# Altium project master-010106.PrjPcb (part 4 of 5)

## Sheet contactor_control.SchDoc: foxBMS BMS-Master
size A3; DocumentNumber: 16; SheetNumber: 16; SheetTotal: 24; Author: Fraunhofer IISB foxBMS Team; REL-DATE: 2017-05-16; VERSION: 1.0.2; SheetDescription: Contactor Control
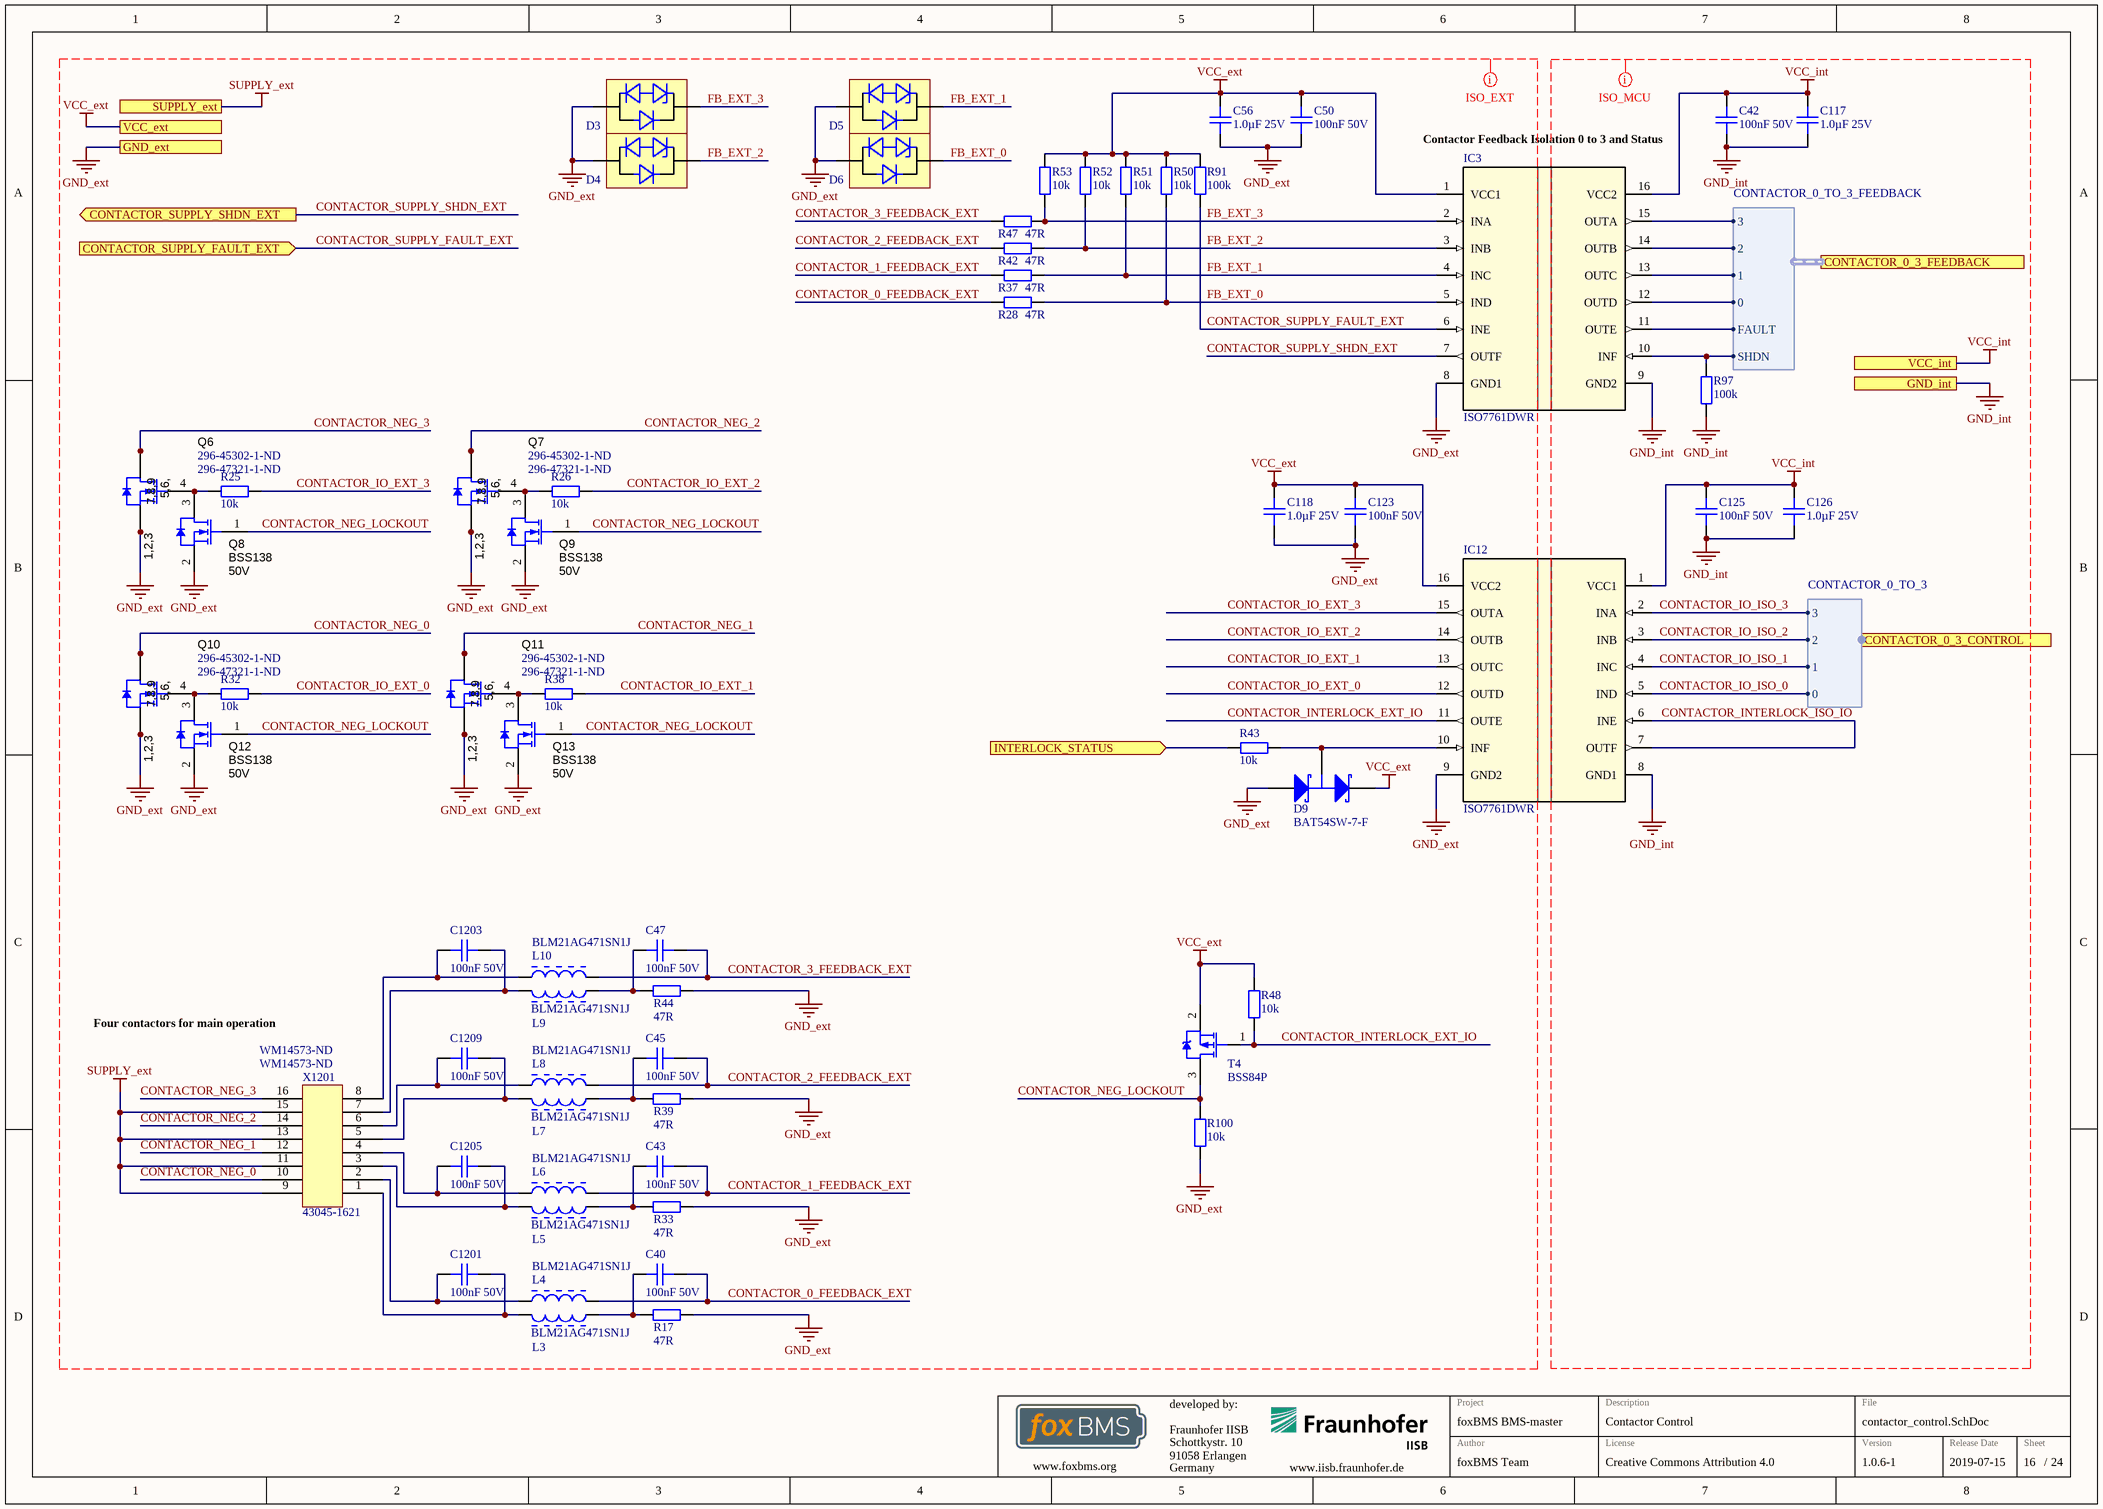
[diagram p18: contactor_control.SchDoc]

### Parts
(Parts that share a designator on the sheet are numbered #1, #2 ... from top to bottom, then left to right.)
C40  100nF 50V  [0603C]
C42  100nF 50V  [0603C]
C43  100nF 50V  [0603C]
C45  100nF 50V  [0603C]
C47  100nF 50V  [0603C]
C50  100nF 50V  [0603C]
C56  1.0µF 25V  [0603C]
C117#2  1.0µF 25V  [0603C]
C118  1.0µF 25V  [0603C]
C123  100nF 50V  [0603C]
C125  100nF 50V  [0603C]
C126  1.0µF 25V  [0603C]
C1201  100nF 50V  [0603C]
C1203  100nF 50V  [0603C]
C1205  100nF 50V  [0603C]
C1209  100nF 50V  [0603C]
D3  CDSOD323-T05  [SODFL250X110-2N]  (value not drawn)
D4  CDSOD323-T05  [SODFL250X110-2N]  (value not drawn)
D5#2  CDSOD323-T05  [SODFL250X110-2N]  (value not drawn)
D6#2  CDSOD323-T05  [SODFL250X110-2N]  (value not drawn)
D9  BAT54SW-7-F  [DIOD-SOT323-3_V]
IC3#1  ISO7761DWR  [DW0016B_N]
IC12  ISO7761DWR  [DW0016B_N]
L3  BLM21AG471SN1J  [MURA-BLM21-H1-CHIP-2_V]
L4  BLM21AG471SN1J  [MURA-BLM21-H1-CHIP-2_V]
L5  BLM21AG471SN1J  [MURA-BLM21-H1-CHIP-2_V]
L6  BLM21AG471SN1J  [MURA-BLM21-H1-CHIP-2_V]
L7  BLM21AG471SN1J  [MURA-BLM21-H1-CHIP-2_V]
L8  BLM21AG471SN1J  [MURA-BLM21-H1-CHIP-2_V]
L9  BLM21AG471SN1J  [MURA-BLM21-H1-CHIP-2_V]
L10  BLM21AG471SN1J  [MURA-BLM21-H1-CHIP-2_V]
Q6  Supplier Part Number 1: 296-45302-1-ND  Supplier Part Number 2: 296-47321-1-ND  [SONQ3A]  (hidden comment: CSD18543Q3A)
Q7  Supplier Part Number 1: 296-45302-1-ND  Supplier Part Number 2: 296-47321-1-ND  [SONQ3A]  (hidden comment: CSD18543Q3A)
Q8  BSS138  value 50V  [SOT-23]
Q9  BSS138  value 50V  [SOT-23]
Q10  Supplier Part Number 1: 296-45302-1-ND  Supplier Part Number 2: 296-47321-1-ND  [SONQ3A]  (hidden comment: CSD18543Q3A)
Q11  Supplier Part Number 1: 296-45302-1-ND  Supplier Part Number 2: 296-47321-1-ND  [SONQ3A]  (hidden comment: CSD18543Q3A)
Q12#2  BSS138  value 50V  [SOT-23]
Q13#2  BSS138  value 50V  [SOT-23]
R17  47R  [0603R]
R25  10k  [0603R]
R26  10k  [0603R]
R28  47R  [0603R]
R32  10k  [0603R]
R33  47R  [0603R]
R37  47R  [0603R]
R38  10k  [0603R]
R39  47R  [0603R]
R42  47R  [0603R]
R43  10k  [0603R]
R44  47R  [0603R]
R47#2  47R  [0603R]
R48#2  10k  [0603R]
R50#2  10k  [0603R]
R51#2  10k  [0603R]
R52#2  10k  [0603R]
R53#2  10k  [0603R]
R91  100k  [0603R]
R97  100k  [0603R]
R100#1  10k  [0603R]
T4  BSS84P  [INF-PG-SOT23_N]
X1201  43045-1621  Supplier Part Number 1: WM14573-ND  [43045-1621]

### Ports
CONTACTOR_0_3_CONTROL (harness CONTACTOR_0_TO_3), CONTACTOR_0_3_FEEDBACK (harness CONTACTOR_0_TO_3_FEEDBACK), CONTACTOR_SUPPLY_FAULT_EXT (in), CONTACTOR_SUPPLY_SHDN_EXT (out), GND_ext, GND_int, INTERLOCK_STATUS (in), SUPPLY_ext, VCC_ext, VCC_int

### Harnesses
CONTACTOR_0_TO_3: 0, 1, 2, 3
CONTACTOR_0_TO_3_FEEDBACK: 0, 1, 2, 3, FAULT, SHDN

### Nets
GND_ext: C42.2 C50.2 C56.2 C117#2.2 C118.2 C123.2 C125.2 C126.2 D3.2(A) D4.2(A) D5#2.2(A) D6#2.2(A) D9.1(A) IC3#1.8(GND1) IC3#1.9(GND2) IC12.8(GND1) IC12.9(GND2) Q6.1(S) Q6.2(S) Q6.3(S) Q7.1(S) Q7.2(S) Q7.3(S) Q8.2(S) Q9.2(S) Q10.1(S) Q10.2(S) Q10.3(S) Q11.1(S) Q11.2(S) Q11.3(S) Q12#2.2(S) Q13#2.2(S) R17.2 R33.2 R39.2 R44.2 R97.1 R100#1.1 ; port GND_int, port GND_ext  [also labelled GND_int]  [project net GND]
SUPPLY_ext: X1201.9 X1201.11 X1201.13 X1201.15 ; port SUPPLY_ext
VCC_ext: C50.1 C56.1 C118.1 C123.1 D9.2(K) IC3#1.1(VCC1) IC12.16(VCC2) R48#2.2 R50#2.2 R51#2.2 R52#2.2 R53#2.2 R91.2 T4.2(SOURCE) ; port VCC_ext  [project net +3.3V_COM]
VCC_int: C42.1 C117#2.1 C125.1 C126.1 IC3#1.16(VCC2) IC12.1(VCC1) ; port VCC_int  [project net +3.3V_0]
CONTACTOR_0_FEEDBACK: IC3#1.12(OUTD) ; port CONTACTOR_0_3_FEEDBACK.0
CONTACTOR_0_FEEDBACK_EXT: C40.2 L4.2 R28.1
CONTACTOR_1_FEEDBACK: IC3#1.13(OUTC) ; port CONTACTOR_0_3_FEEDBACK.1
CONTACTOR_1_FEEDBACK_EXT: C43.2 L6.2 R37.1
CONTACTOR_2_FEEDBACK: IC3#1.14(OUTB) ; port CONTACTOR_0_3_FEEDBACK.2
CONTACTOR_2_FEEDBACK_EXT: C45.2 L8.2 R42.1
CONTACTOR_3_FEEDBACK: IC3#1.15(OUTA) ; port CONTACTOR_0_3_FEEDBACK.3
CONTACTOR_3_FEEDBACK_EXT: C47.2 L10.2 R47#2.2
CONTACTOR_INTERLOCK_EXT_IO: IC12.11(OUTE) R48#2.1 T4.1(GATE)
CONTACTOR_INTERLOCK_ISO_IO: IC12.6(INE) IC12.7(OUTF)
CONTACTOR_IO_EXT_0: IC12.12(OUTD) R32.1
CONTACTOR_IO_EXT_1: IC12.13(OUTC) R38.1
CONTACTOR_IO_EXT_2: IC12.14(OUTB) R26.1
CONTACTOR_IO_EXT_3: IC12.15(OUTA) R25.1
CONTACTOR_IO_ISO_0: IC12.5(IND) ; port CONTACTOR_0_3_CONTROL.0  [project net CONTACTOR_0_CONTROL]
CONTACTOR_IO_ISO_1: IC12.4(INC) ; port CONTACTOR_0_3_CONTROL.1  [project net CONTACTOR_1_CONTROL]
CONTACTOR_IO_ISO_2: IC12.3(INB) ; port CONTACTOR_0_3_CONTROL.2  [project net CONTACTOR_2_CONTROL]
CONTACTOR_IO_ISO_3: IC12.2(INA) ; port CONTACTOR_0_3_CONTROL.3  [project net CONTACTOR_3_CONTROL]
CONTACTOR_NEG_0: Q10.5(D) Q10.6(D) Q10.7(D) Q10.8(D) Q10.9(D) X1201.10
CONTACTOR_NEG_1: Q11.5(D) Q11.6(D) Q11.7(D) Q11.8(D) Q11.9(D) X1201.12
CONTACTOR_NEG_2: Q7.5(D) Q7.6(D) Q7.7(D) Q7.8(D) Q7.9(D) X1201.14
CONTACTOR_NEG_3: Q6.5(D) Q6.6(D) Q6.7(D) Q6.8(D) Q6.9(D) X1201.16
CONTACTOR_NEG_LOCKOUT: Q8.1(G) Q9.1(G) Q12#2.1(G) Q13#2.1(G) R100#1.2 T4.3(DRAIN)
CONTACTOR_SUPPLY_FAULT: IC3#1.11(OUTE) ; port CONTACTOR_0_3_FEEDBACK.FAULT
CONTACTOR_SUPPLY_FAULT_EXT: IC3#1.6(INE) R91.1 ; port CONTACTOR_SUPPLY_FAULT_EXT
CONTACTOR_SUPPLY_SHDN: IC3#1.10(INF) R97.2 ; port CONTACTOR_0_3_FEEDBACK.SHDN
CONTACTOR_SUPPLY_SHDN_EXT: IC3#1.7(OUTF) ; port CONTACTOR_SUPPLY_SHDN_EXT
FB_EXT_0: D6#2.1(K) IC3#1.5(IND) R28.2 R50#2.1
FB_EXT_1: D5#2.1(K) IC3#1.4(INC) R37.2 R51#2.1
FB_EXT_2: D4.1(K) IC3#1.3(INB) R42.2 R52#2.1
FB_EXT_3: D3.1(K) IC3#1.2(INA) R47#2.1 R53#2.1
INTERLOCK_STATUS: R43.2 ; port INTERLOCK_STATUS
NetC40_1: C40.1 L3.2 R17.1
NetC43_1: C43.1 L5.2 R33.1
NetC45_1: C45.1 L7.2 R39.1
NetC47_1: C47.1 L9.2 R44.1
NetC1201_1: C1201.1 L4.1 X1201.2
NetC1201_2: C1201.2 L3.1 X1201.1
NetC1203_1: C1203.1 L10.1 X1201.8
NetC1203_2: C1203.2 L9.1 X1201.7
NetC1205_1: C1205.1 L6.1 X1201.4
NetC1205_2: C1205.2 L5.1 X1201.3
NetC1209_1: C1209.1 L8.1 X1201.6
NetC1209_2: C1209.2 L7.1 X1201.5
NetD9_3: D9.3(C) IC12.10(INF) R43.1
NetQ6_4: Q6.4(G) Q8.3(D) R25.2
NetQ7_4: Q7.4(G) Q9.3(D) R26.2
NetQ10_4: Q10.4(G) Q12#2.3(D) R32.2
NetQ11_4: Q11.4(G) Q13#2.3(D) R38.2

### Layout directives
net class ISO_MCU: CONTACTOR_INTERLOCK_ISO_IO, CONTACTOR_IO_ISO_0, CONTACTOR_IO_ISO_1, CONTACTOR_IO_ISO_2, CONTACTOR_IO_ISO_3, GND_int, VCC_int
net class ISO_EXT: CONTACTOR_0_FEEDBACK_EXT, CONTACTOR_1_FEEDBACK_EXT, CONTACTOR_2_FEEDBACK_EXT, CONTACTOR_3_FEEDBACK_EXT, CONTACTOR_INTERLOCK_EXT_IO, CONTACTOR_IO_EXT_0, CONTACTOR_IO_EXT_1, CONTACTOR_IO_EXT_2, CONTACTOR_IO_EXT_3, CONTACTOR_NEG_0, CONTACTOR_NEG_1, CONTACTOR_NEG_2, CONTACTOR_NEG_3, CONTACTOR_NEG_LOCKOUT, CONTACTOR_SUPPLY_FAULT_EXT, CONTACTOR_SUPPLY_SHDN_EXT, FB_EXT_0, FB_EXT_1, FB_EXT_2, FB_EXT_3, GND_ext, SUPPLY_ext, VCC_ext

### Notes on the sheet
- (near C42) Contactor Feedback Isolation 0 to 3 and Status
- Four contactors for main operation
- Fraunhofer IISB
- Schottkystr. 10
- developed by:
- 91058 Erlangen
- Germany
- Author
- Project
- License
- Description
- File
- Version
- Release Date
- Sheet
- www.foxbms.org
- www.iisb.fraunhofer.de
- foxBMS Team
- /
- (in symbol CSD18543Q3A) 7,8,9; 5,6,; 1,2,3

### Library data of the parts
C40 C42 C43 C45 C47 C50 C123 C125 C1201 C1203 C1205 C1209 = gen_C_ceramic_100n_50V_X7R_0603: Ceramic, 100nF, ±10%, 50V, X7R, –55 to 125°C, 0603 (1608),RoHS, Automotive; Part Number: GCJ188R71H104KA12; Manufacturer: Murata; Capacitance: 100n; Case EIA: 0603; Case Metric: 1608; PnP Package: C_0603_10; PnP Value: 100nF/50V/X7R; PnP equipped: x; Automotive Qualified: True; Rated Voltage: 50V; Dielectric: X7R; Supplier 1: Digi-Key; Supplier Part Number 1: 490-5798-1-ND; Height - Seated (Max): 0.8mm; Mounting Type: SurfaceMount,MLCC; Operating Temperature: –55 to 125°C; Series: GCJ; Tolerance: ±10%; Manufacturer_Part_Number: GCJ188R71H104KA12
C56 C117#2 C118 C126 = gen_C_ceramic_1u_25V_X7R_0603: Ceramic, 1.0µF, ±10%, 25V, X7R, –55 to 125°C, 0603 (1608),RoHS, Automotive; Part Number: GCJ188R71E105KA01; Manufacturer: Murata; Capacitance: 1µF; Case EIA: 0603; Case Metric: 1608; PnP Package: C_0603_10; PnP Value: 1.0µF/25V/X7R; Automotive Qualified: True; Rated Voltage: 25V; Dielectric: X7R; Supplier 1: Digi-Key; Supplier Part Number 1: 490-14409-1-ND; Height - Seated (Max): 0.8mm; Mounting Type: SurfaceMount,MLCC; Operating Temperature: –55 to 125°C; Series: GCJ; Tolerance: ±10%; Manufacturer_Part_Number: GCJ188R71E105KA01
D3 D4 D5#2 D6#2 = CDSOD323-T05: TVS Diode, CDSOD323 Series, Unidirectional, 5 V, 18.3 V, SOD-323, 2 Pins; Manufacturer: Bourns; Breakdown Voltage: 6V; Automotive Qualified: False; Part Number: CDSOD323-T05; Part Name: CDSOD323-T05; Operating Temperature: -55°C - +150°C; ComponentLink1Description: Datasheet; ComponentLink1URL: http://www.farnell.com/datasheets/1845299.pdf; Supplier 1: Farnell; Supplier Part Number 1: 2341914
D9 = CMP-2000-05929-1: Schottky Barrier Diode, 30 V, 200 mA, -65 to 125 degC, 3-Pin SOT323, RoHS, Tape and Reel; Unit Weight: 0.000212oz; Ifsm - Forward Surge Current: 0.6A; Vf - Forward Voltage: 1Vat0.1A; Brand: DiodesIncorporated; Pd - Power Dissipation: 200mW; Ir - Reverse Current: 2uAat25V; Type: SurfaceMountSchottkyBarrierDiodeArray; Vrrm - Repetitive Reverse Voltage: 30V; If - Forward Current: 0.2A; trr - Reverse Recovery time: 5ns; Configuration: DualSeries; Minimum Operating Temperature: -65C; Mounting Style: SMD/SMT; Manufacturer URL: http://www.diodes.com/; Mounting Technology: SurfaceMount; Packaging: Reel; Length: 2.2mm; Product Category: SchottkyDiodes&Rectifiers; Datasheet Version: Rev. 15-2, 03/2014; Series: BAT54; Operating Temperature Range: -65Cto+125C; Manufacturer: DiodesIncorporated; Technology: Si; Datasheet URL: http://www.diodes.com/_files/datasheets/ds30065.pdf; Height: 1mm; Width: 1.35mm; Termination Style: SMD/SMT; Maximum Operating Temperature: +125C; Product: SchottkyDiodes; Package / Case: SOT-323; Package Reference: SOT323; RoHS: True; Package Description: 3-Pin Small Outline Transistor, Body 2 x 1.25 mm, Pitch 0.65 mm; Factory Pack Quantity: 3000
IC3#1 IC12 = ISO7761DWR: Imported; Manufacturer: Texas Instruments; PartNumber: ISO7761DWR; RefDes: RefDes; TYPE: TYPE; Value: Value
L3-L10 = C5133952-28DE-41F1-874F-4A9C3E40D898: Chip Ferrite Bead for General Signal lines, 470 Ohm, 700 mA, -55 to 125 degC, 2 x 1.25 x 1.05 mm SMD, Tape and Reel; Manufacturer: Murata; DC Resistance: 0.19 Ohm Max.; Impedance (at 100 MHz): 470 Ohm +/- 25%; Rated Current: 700 mA; ComponentLink1URL: http://www.murata.com/; Packing: Tape and Reel; PackageDescription: 2-Pin Chip, Body 2 x 1.25 mm; ComponentLink3Description: Package Specification; Operating Temperature Range: -55 to 125 degC; ComponentLink1Description: Manufacturer URL; PartNumber: BLM21AG471SN1J; DatasheetVersion: 08/2013; Mounting Technology: Surface Mount; ComponentLink2URL: http://www.murata.com/products/catalog/pdf/c31e.pdf; ComponentLink3URL: http://www.murata.com/products/catalog/pdf/c31e.pdf; ComponentLink2Description: Datasheet; PackageReference: BLM21_H1050-2; Part Number: BLM21AG471SN1J
Q6 Q7 Q10 Q11 = CSD18543Q3A: 60V, N ch NexFET MOSFET™, single SON3x3, 9.9mOhm; Manufacturer: Texas Instruments; Alternate Manufacturer: None; CompType: MOSFET; Value: 30V; U/M: EA; VdsMax_V: 60; Value1: 0.0081 ohm; Rdson45_Ohm: 0.0081; Value2: 1.7 nC; QgTyp_nC: 1.7; Vgs_V: 10; IdsMax_A: 156; SymbolVersion: 2008-07-09; PartNumber: CSD18543Q3A; PackageReference: SON 3.3x3.3mm; ChType: N; RoHS: Y; MountType: SMT; Published: 2008-06-19; Publisher: Texas Instruments; LatestRevisionDate: 2013-07-24; LatestRevisionNote: Added parts.; ComponentLink1Description: Datasheet link; ComponentLink1URL: http://www.ti.com/lit/ds/symlink/csd18543q3a.pdf; Supplier 1: Digi-Key; Supplier 2: Digi-Key
Q8 Q9 Q12#2 Q13#2 = BSS138: MOSFET, N-CH, 50V, 0.22A, SOT-23; Manufacturer: Fairchild Semiconductor; Alternate Manufacturer: None; U/M: EA; ChType: N; VdsMax_V: 50; Value1: 6 ohm; Rdson45_Ohm: 6; Value2: 1.7 nC; QgTyp_nC: 1.7; Vgs_V: 20; IdsMax_A: 0.22; ComponentLink1URL: http://www.fairchildsemi.com/ds/BS/BSS138.pdf; SymbolVersion: 2008-07-28; PackageReference: SOT-23; PartNumber: BSS138; ComponentLink1Description: Datasheet link; CompType: MOSFET; RoHS: Y; MountType: SMT; Published: 2008-06-19; Publisher: Texas Instruments; LatestRevisionDate: 2013-07-10; LatestRevisionNote: Added parts.; Supplier 1: Digi-Key; Supplier Part Number 1: BSS138CT-ND; Supplier 2: Mouser; Supplier Part Number 2: 512-BSS138; Supplier 3: Farnell; Supplier Part Number 3: 9845330
R17 R28 R33 R37 R39 R42 R44 R47#2 = gen_R_47R_0603: SMD Resistor 47R 0603; Tolerance: 1%; Power: 0.1W; Case EIA: 0603; Case Metric: 1608; Maximum Working Voltage: 75V; PnP Package: R_0603; Automotive Qualified: False; Part Number: gen_R_47R_0603; Operating Temperature: -55°C - +155°C; Resistance: 47R; Series: E24; PnP Value: 47R; Supplier 1: Farnell; Supplier Part Number 1: 2303030
R25 R26 R32 R38 R43 R48#2 R50#2 R51#2 R52#2 R53#2 R100#1 = gen_R_10k_0603: SMD Resistor 10k 0603; Tolerance: 1%; Power: 0.1W; Case EIA: 0603; Case Metric: 1608; Maximum Working Voltage: 75V; PnP Package: R_0603; Automotive Qualified: False; Part Number: gen_R_10k_0603; Operating Temperature: -55°C - +155°C; Resistance: 10k; Series: E24, E96; PnP Value: 10k; Supplier 1: Farnell; Supplier Part Number 1: 2073349
R91 R97 = gen_R_100k_0603: SMD Resistor 100k 0603; Case EIA: 0603; Case Metric: 1608; PnP Package: R_0603; Automotive Qualified: False; Operating Temperature: -55°C - +155°C; PnP Value: 100k; Part Number: gen_R_100k_0603
T4 = CMP-1099-00028-1: P-Channel SIPMOS Small-Signal-Transistor, -60 V VDS, -0.17 A ID, -55 to 150 degC, PG-SOT23, Reel, Green; Manufacturer: Infineon; VGS(th) (max): -2Â V; VGS(th) (min): -1Â V; VDS (max): -60Â V; Rth: 350Â K/W; Pto t (max): 0.36Â W; ID (max): -0.17Â A; IDpuls (max): -0.68Â A; RDS (on) (max) (@4.5V): 12,000Â mOhm; QG: 1Â nC; Green: TRUE; RDS (on) (max): 8,000Â mOhm; ComponentLink3URL: http://www.infineon.com/dgdl/SOT23-Package_Overview.pdf?folderId=db3a30431936bc4b0119532290053c66&fileId=db3a30431936bc4b0119533468123c85; ComponentLink3Description: Package Specification; Packing: Reel; PartNumber: BSS84P; ComponentLink2Description: Datasheet; Mounting Technology: Surface Mount; ComponentLink2URL: http://www.infineon.com/dgdl/BSS84P_Rev2.7%5B1%5D.pdf?folderId=db3a304314dca38901154a72e3951a65&fileId=db3a304330f68606013118ac7a9b4549; PackageReference: PG-SOT23; ComponentLink1URL: http://www.infineon.com/; PackageVersion: Apr-08; ComponentLink1Description: Manufacturer URL; PackageDescription: 3-Pin Small Outline Transistor Package, 2.9 x 1.3 mm Body, 0.95 mm Pitch; Halogen-free: TRUE; DatasheetVersion: Rev. 2.7
X1201 = molex_microfit_3_08x2_THT: Micro-Fit 3.0 Right Angle Header, 3.00mm Pitch, Dual Row, 16 Circuits, with Snap-in Plastic Peg PCB Lock, Tin, Glow Wire Capable, Black, 43045-1600; Manufacturer: Molex; Circuits: 16; Rated Voltage: 600V; Rated Current: 8.5A; Automotive Qualified: False; Part Number: molex_microfit_3_08x2_THT; Part Name: MicroFit; Operating Temperature: -40°C - +105°C; Supplier 1: Digi-Key; Supplier 2: Digi-Key; Supplier Part Number 2: WM14573-ND

## Sheet EEPROM.SchDoc: foxBMS BMS-Master
size A3; DocumentNumber: 20; SheetNumber: 20; SheetTotal: 24; Author: Fraunhofer IISB foxBMS Team; REL-DATE: 2017-05-16; VERSION: 1.0.2; SheetDescription: EEPROM
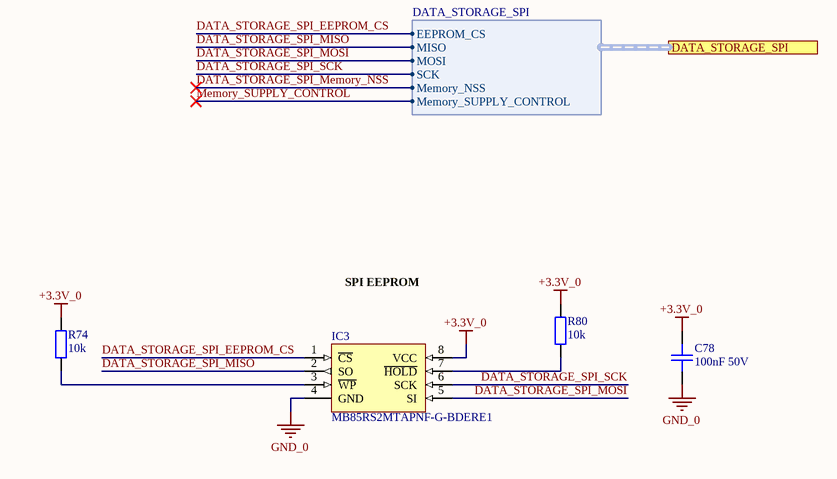
[diagram p19: EEPROM.SchDoc]

### Parts
(Parts that share a designator on the sheet are numbered #1, #2 ... from top to bottom, then left to right.)
C78#2  100nF 50V  [0603C]
IC3#2  MB85RS2MTAPNF-G-BDERE1  [SOIC127P600X175-8N]
R74  10k  [0603R]
R80  10k  [0603R]

### Ports
DATA_STORAGE_SPI (harness DATA_STORAGE_SPI)

### Harnesses
DATA_STORAGE_SPI: EEPROM_CS, MISO, MOSI, SCK, Memory_NSS, Memory_SUPPLY_CONTROL

### Nets
+3.3V_0: C78#2.2 IC3#2.8(VCC) R74.2 R80.2
GND_0: C78#2.1 IC3#2.4(GND)  [project net GND]
DATA_STORAGE_SPI_EEPROM_CS: IC3#2.1(~{CS}) ; port DATA_STORAGE_SPI.EEPROM_CS
DATA_STORAGE_SPI_MISO: IC3#2.2(SO) ; port DATA_STORAGE_SPI.MISO
DATA_STORAGE_SPI_MOSI: IC3#2.5(SI) ; port DATA_STORAGE_SPI.MOSI
DATA_STORAGE_SPI_SCK: IC3#2.6(SCK) ; port DATA_STORAGE_SPI.SCK
NetIC3#2_3: IC3#2.3(~{WP}) R74.1
NetIC3#2_7: IC3#2.7(~{HOLD}) R80.1

### Notes on the sheet
- SPI EEPROM
- Fraunhofer IISB
- Schottkystr. 10
- developed by:
- 91058 Erlangen
- Germany
- Author
- Project
- License
- Description
- File
- Version
- Release Date
- Sheet
- www.foxbms.org
- www.iisb.fraunhofer.de
- foxBMS Team
- /

### Library data of the parts
C78#2 = gen_C_ceramic_100n_50V_X7R_0603: as C40 on sheet contactor_control; Rated Voltage: 50V; Dielectric: X7R; Supplier 1: Digi-Key; Supplier Part Number 1: 490-5798-1-ND; Height - Seated (Max): 0.8mm; Mounting Type: SurfaceMount,MLCC; Operating Temperature: –55 to 125°C; Series: GCJ; Tolerance: ±10%; Manufacturer_Part_Number: GCJ188R71H104KA12
IC3#2 = M95M02-DRMN6TP: FRAM (Ferroelectric RAM) Memory IC 2Mb (256K x 8) SPI 40MHz 8-SOP; Manufacturer: Fujitsu Electronics America, Inc.; PnP Package: SOIC-8; Automotive Qualified: False; Part Number: MB85RS2MTAPNF-G-BDERE1; Part Name: MB85RS2MTAPNF-G-BDERE1; Operating Temperature: -40°C - +85°C; ComponentLink1Description: Datasheet; ComponentLink1URL: http://www.st.com/resource/en/datasheet/m95m02-dr.pdf; Supplier 1: Digikey; Supplier Part Number 1: 865-1286-1-ND
R74 R80 = gen_R_10k_0603: as R25 on sheet contactor_control; Part Number: gen_R_10k_0603; Operating Temperature: -55°C - +155°C; Resistance: 10k; Series: E24, E96; PnP Value: 10k; Supplier 1: Farnell; Supplier Part Number 1: 2073349

## Sheet bms-interface_interface.SchDoc: foxBMS BMS-Master
size A3; DocumentNumber: 21; SheetNumber: 21; SheetTotal: 24; Author: Fraunhofer IISB foxBMS Team; REL-DATE: 2017-05-16; VERSION: 1.0.2; SheetDescription: Interface to BMS-Interface
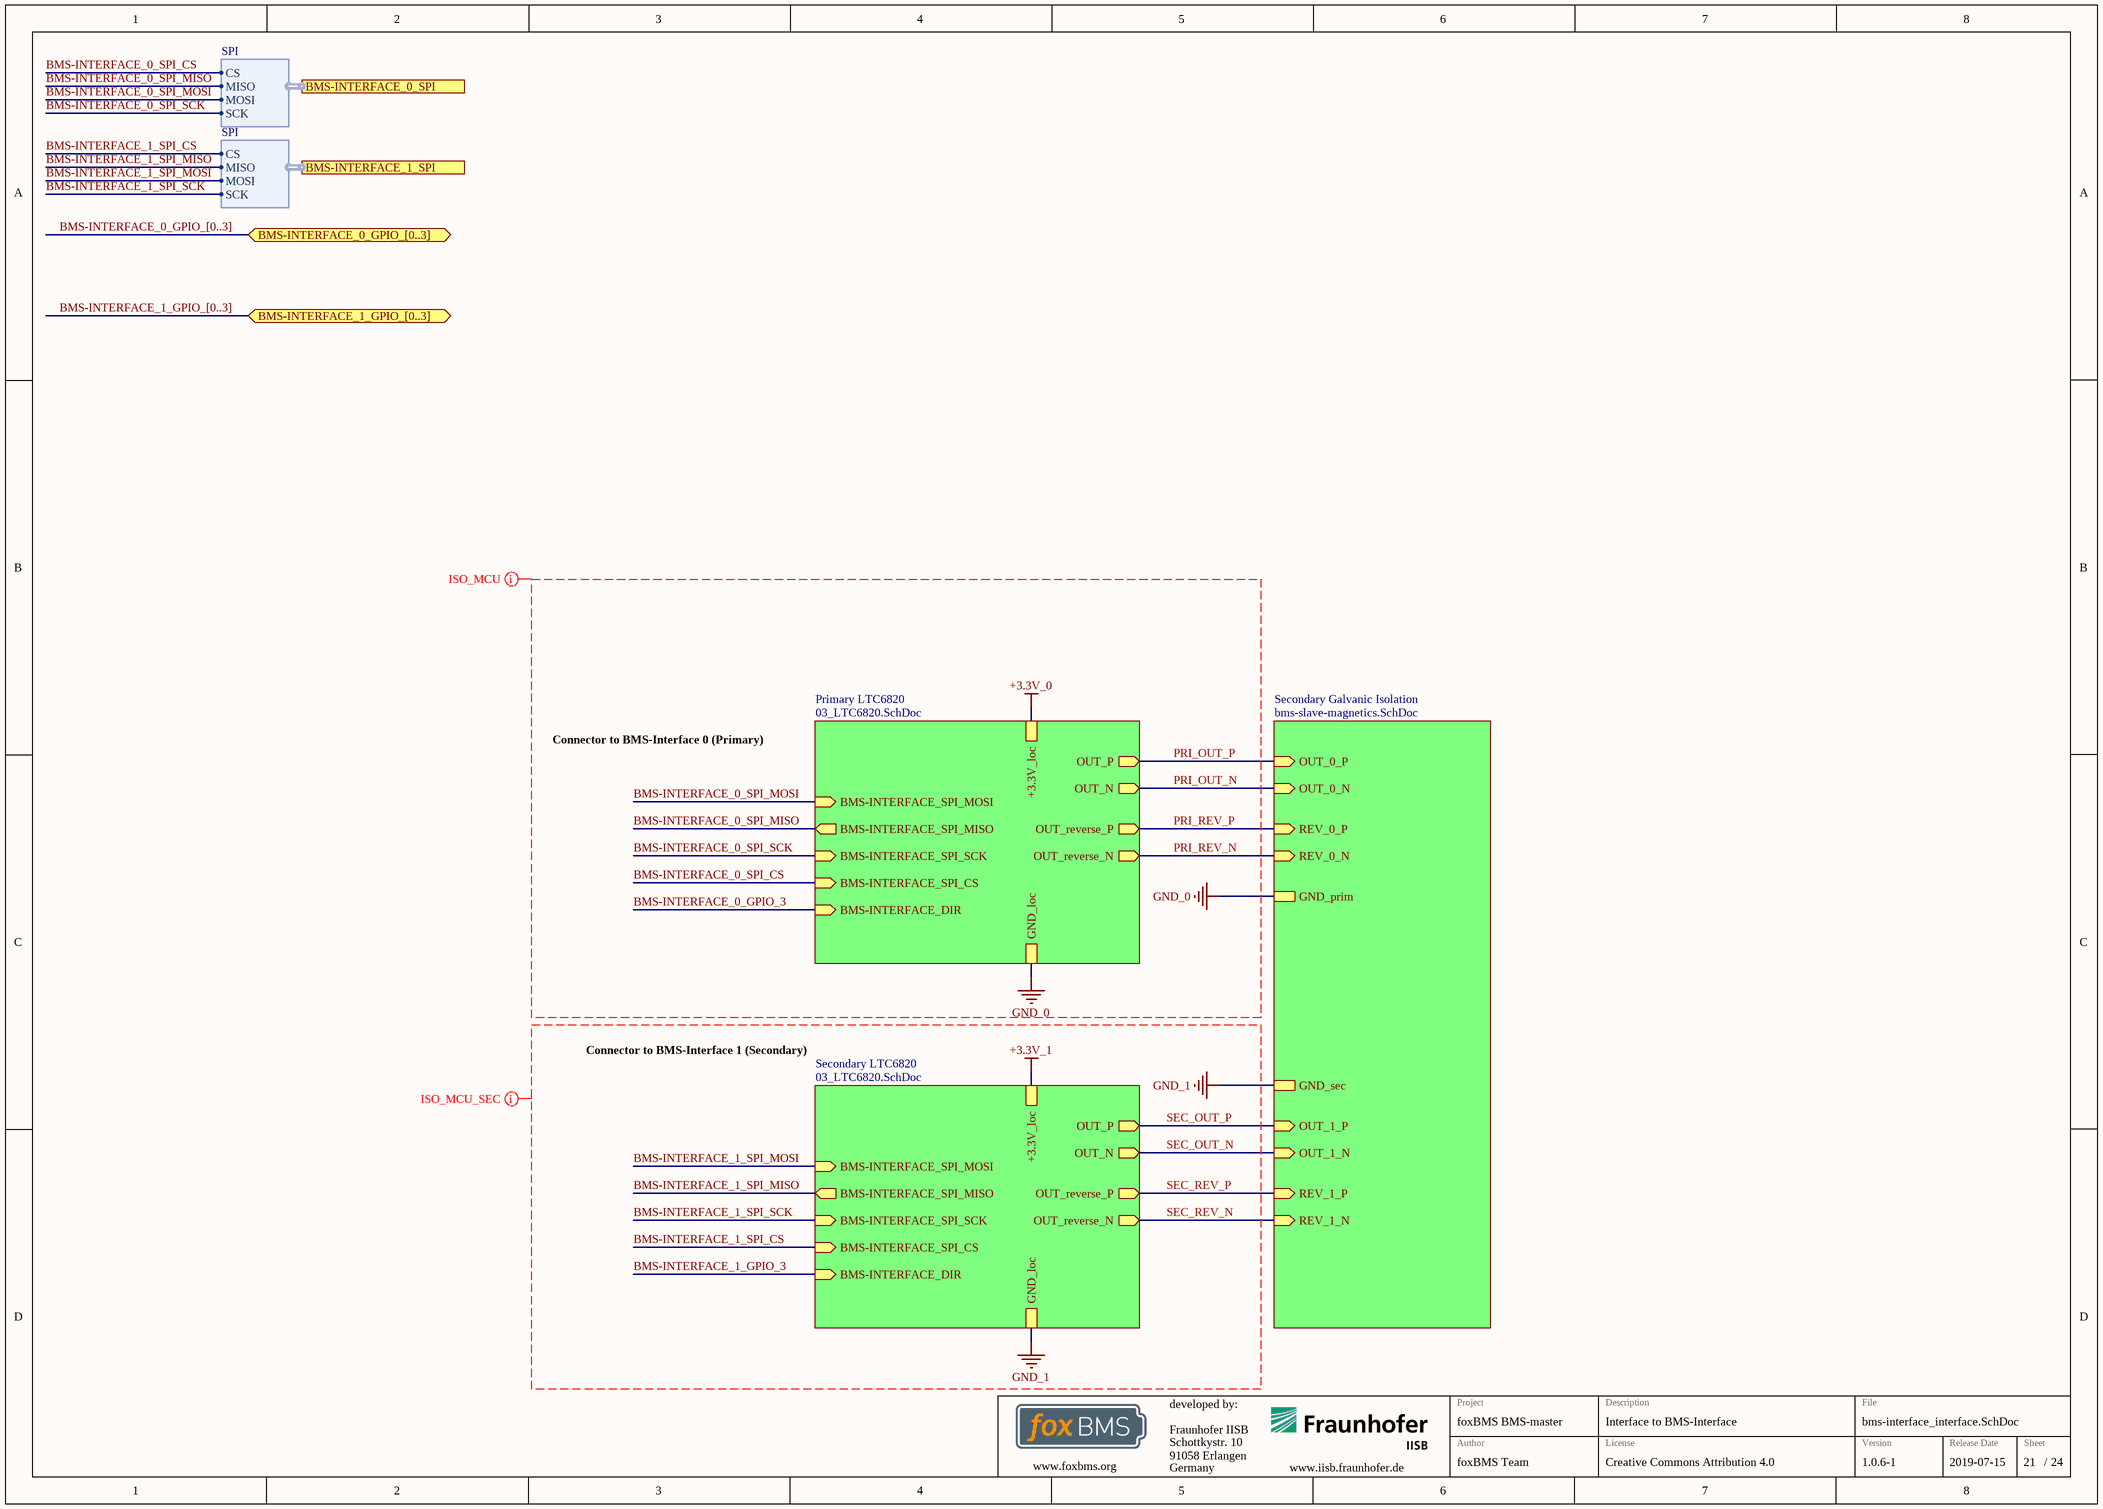
[diagram p20: bms-interface_interface.SchDoc]

### Sub-sheets
Primary LTC6820 = 03_LTC6820.SchDoc: BMS-INTERFACE_SPI_CS (in), BMS-INTERFACE_SPI_SCK (in), BMS-INTERFACE_SPI_MOSI (in), BMS-INTERFACE_SPI_MISO (out), OUT_P (out), OUT_N (out), +3.3V_loc, GND_loc, OUT_reverse_P (out), OUT_reverse_N (out), BMS-INTERFACE_DIR (in)
Secondary Galvanic Isolation = bms-slave-magnetics.SchDoc: REV_0_N (in), OUT_0_P (in), OUT_1_N (in), OUT_0_N (in), REV_1_N (in), REV_1_P (in), REV_0_P (in), OUT_1_P (in), GND_prim, GND_sec
Secondary LTC6820 = 03_LTC6820.SchDoc: BMS-INTERFACE_SPI_CS (in), BMS-INTERFACE_SPI_MOSI (in), BMS-INTERFACE_SPI_MISO (out), BMS-INTERFACE_SPI_SCK (in), OUT_N (out), OUT_P (out), +3.3V_loc, GND_loc, OUT_reverse_P (out), OUT_reverse_N (out), BMS-INTERFACE_DIR (in)

### Ports
BMS-INTERFACE_0_GPIO_[0..3] (bidir), BMS-INTERFACE_0_SPI (harness SPI), BMS-INTERFACE_1_GPIO_[0..3] (bidir), BMS-INTERFACE_1_SPI (harness SPI)

### Harnesses
SPI: CS, MISO, MOSI, SCK

### Nets
+3.3V_0: sheet Primary LTC6820/+3.3V_loc, sheet Secondary LTC6820/+3.3V_loc  [also labelled +3.3V_1]
GND_0: sheet Primary LTC6820/GND_loc, sheet Secondary Galvanic Isolation/GND_prim, sheet Secondary Galvanic Isolation/GND_sec, sheet Secondary LTC6820/GND_loc  [also labelled GND_1]  [project net GND]
BMS-INTERFACE_0_SPI_CS: sheet Primary LTC6820/BMS-INTERFACE_SPI_CS, port BMS-INTERFACE_0_SPI.CS
BMS-INTERFACE_0_SPI_MISO: sheet Primary LTC6820/BMS-INTERFACE_SPI_MISO, port BMS-INTERFACE_0_SPI.MISO
BMS-INTERFACE_0_SPI_MOSI: sheet Primary LTC6820/BMS-INTERFACE_SPI_MOSI, port BMS-INTERFACE_0_SPI.MOSI
BMS-INTERFACE_0_SPI_SCK: sheet Primary LTC6820/BMS-INTERFACE_SPI_SCK, port BMS-INTERFACE_0_SPI.SCK
BMS-INTERFACE_1_SPI_CS: sheet Secondary LTC6820/BMS-INTERFACE_SPI_CS, port BMS-INTERFACE_1_SPI.CS
BMS-INTERFACE_1_SPI_MISO: sheet Secondary LTC6820/BMS-INTERFACE_SPI_MISO, port BMS-INTERFACE_1_SPI.MISO
BMS-INTERFACE_1_SPI_MOSI: sheet Secondary LTC6820/BMS-INTERFACE_SPI_MOSI, port BMS-INTERFACE_1_SPI.MOSI
BMS-INTERFACE_1_SPI_SCK: sheet Secondary LTC6820/BMS-INTERFACE_SPI_SCK, port BMS-INTERFACE_1_SPI.SCK
PRI_OUT_N: sheet Primary LTC6820/OUT_N, sheet Secondary Galvanic Isolation/OUT_0_N  [project net OUT_N]
PRI_OUT_P: sheet Primary LTC6820/OUT_P, sheet Secondary Galvanic Isolation/OUT_0_P  [project net OUT_P]
PRI_REV_N: sheet Primary LTC6820/OUT_reverse_N, sheet Secondary Galvanic Isolation/REV_0_N  [project net OUT_N]
PRI_REV_P: sheet Primary LTC6820/OUT_reverse_P, sheet Secondary Galvanic Isolation/REV_0_P  [project net OUT_P]
SEC_OUT_N: sheet Secondary Galvanic Isolation/OUT_1_N, sheet Secondary LTC6820/OUT_N  [project net OUT_N]
SEC_OUT_P: sheet Secondary Galvanic Isolation/OUT_1_P, sheet Secondary LTC6820/OUT_P  [project net OUT_P]
SEC_REV_N: sheet Secondary Galvanic Isolation/REV_1_N, sheet Secondary LTC6820/OUT_reverse_N  [project net OUT_N]
SEC_REV_P: sheet Secondary Galvanic Isolation/REV_1_P, sheet Secondary LTC6820/OUT_reverse_P  [project net OUT_P]

### Buses and harness runs
bus BMS-INTERFACE_0_GPIO_[0..3] = port BMS-INTERFACE_0_GPIO_[0..3]
bus BMS-INTERFACE_1_GPIO_[0..3] = port BMS-INTERFACE_1_GPIO_[0..3]

### Layout directives
net class ISO_MCU: +3.3V_0, BMS-INTERFACE_0_GPIO_3, BMS-INTERFACE_0_SPI_CS, BMS-INTERFACE_0_SPI_MISO, BMS-INTERFACE_0_SPI_MOSI, BMS-INTERFACE_0_SPI_SCK, GND_0, PRI_OUT_N, PRI_OUT_P, PRI_REV_N, PRI_REV_P
net class ISO_MCU_SEC: +3.3V_1, BMS-INTERFACE_1_GPIO_3, BMS-INTERFACE_1_SPI_CS, BMS-INTERFACE_1_SPI_MISO, BMS-INTERFACE_1_SPI_MOSI, BMS-INTERFACE_1_SPI_SCK, GND_1, SEC_OUT_N, SEC_OUT_P, SEC_REV_N, SEC_REV_P

### Notes on the sheet
- Connector to BMS-Interface 0 (Primary)
- Connector to BMS-Interface 1 (Secondary)
- Fraunhofer IISB
- Schottkystr. 10
- developed by:
- 91058 Erlangen
- Germany
- Author
- Project
- License
- Description
- File
- Version
- Release Date
- Sheet
- www.foxbms.org
- www.iisb.fraunhofer.de
- foxBMS Team
- /

## Sheet 03_LTC6820.SchDoc: foxBMS BMS-Interface
size A3; DocumentNumber: 3; SheetNumber: 3; SheetTotal: 6; Author: Fraunhofer IISB foxBMS Team; REL-DATE: 2017-05-09; VERSION: 1.1.0; GateName_1: G$1; SymbolName_1: FRAME_B_L; LibraryName: foxBMS_BMS-Master_V1.00_A; DeviceSetName: FRAME_B_L; GateName_2: G$2; SymbolName_2: DOCFIELD; SheetDescription: Two LTC6820 for forward and reverese isoSPI
Used 2 times, as channels U_15_bms-interface_interface/Primary LTC6820, U_15_bms-interface_interface/Secondary LTC6820. Parts and nets are listed once, with the designators drawn on the sheet.
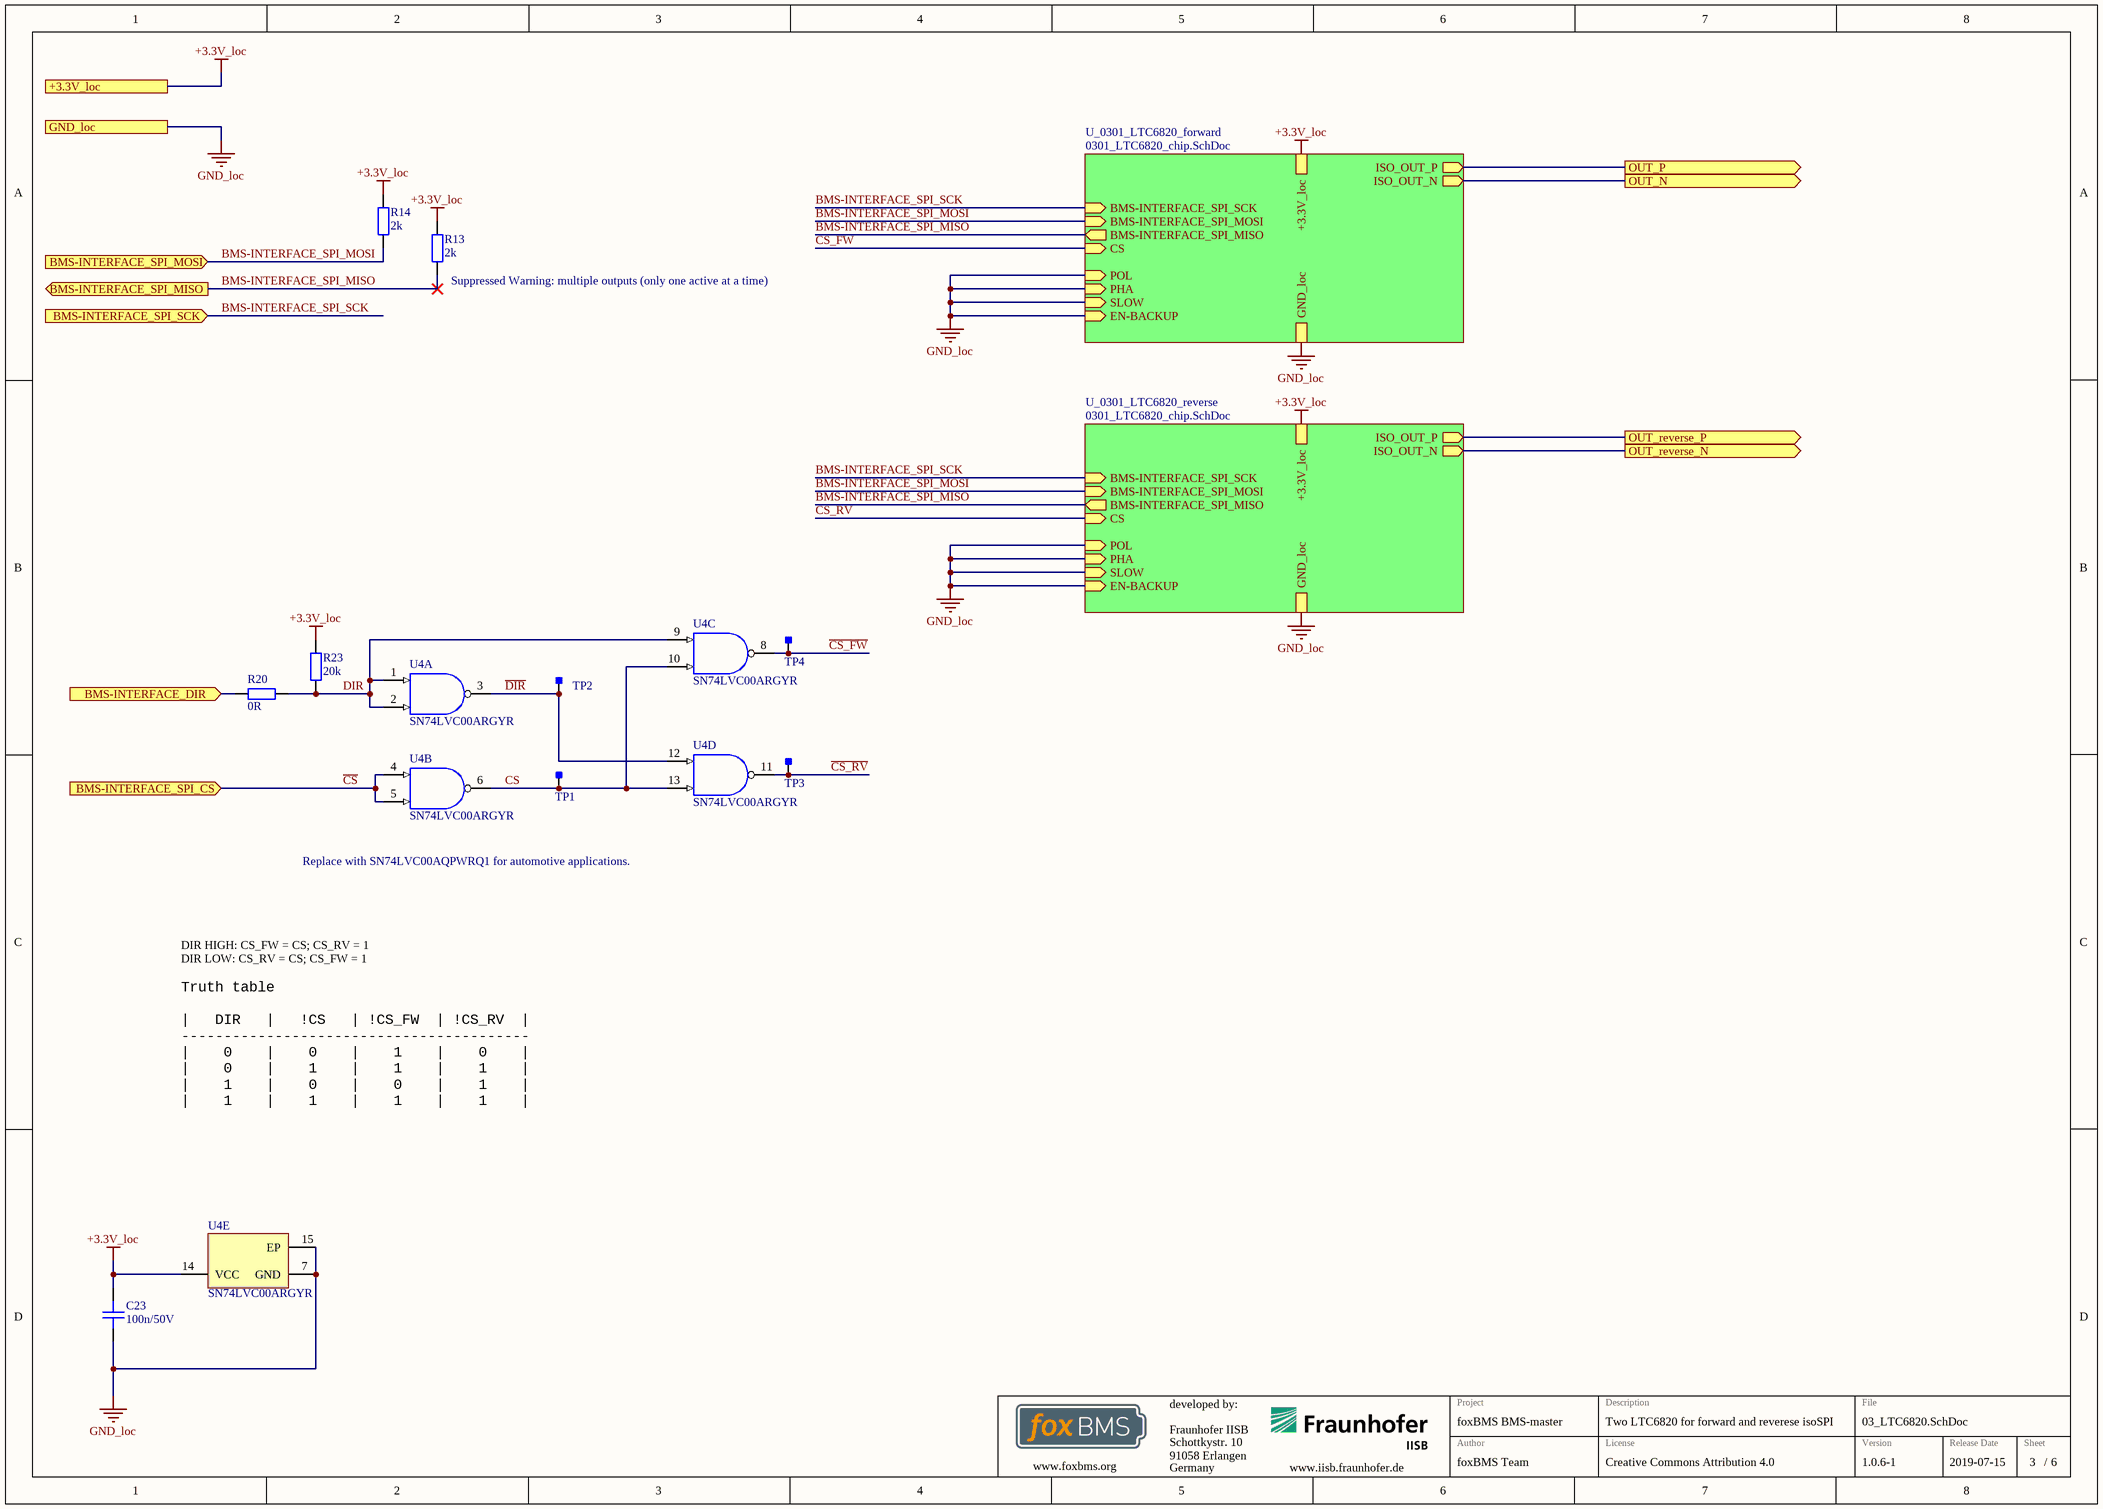
[diagram p21: 03_LTC6820.SchDoc]

### Parts
C23  100n/50V  [0603C]
R13  2k  [0603R]
R14  2k  [0603R]
R20  0R  [0603R]
R23  20k  [0603R]
TP1  CS  [Testpoint_S1]  (value not drawn)  (no BOM)
TP2  DIR  [Testpoint_S1]  (value not drawn)  (no BOM)
TP3  CS_RV  [Testpoint_S1]  (value not drawn)  (no BOM)
TP4  CS_FW  [Testpoint_S1]  (value not drawn)  (no BOM)
U4  SN74LVC00ARGYR  [RGY0014A_V]  (parts A,B,C,D,E of 5)

### Sub-sheets
U_0301_LTC6820_forward = 0301_LTC6820_chip.SchDoc: ISO_OUT_P (out), ISO_OUT_N (out), +3.3V_loc, GND_loc, BMS-INTERFACE_SPI_MISO (out), BMS-INTERFACE_SPI_SCK (in), BMS-INTERFACE_SPI_MOSI (in), POL (in), PHA (in), SLOW (in), EN-BACKUP (in), CS (in)
U_0301_LTC6820_reverse = 0301_LTC6820_chip.SchDoc: ISO_OUT_P (out), ISO_OUT_N (out), +3.3V_loc, GND_loc, BMS-INTERFACE_SPI_MISO (out), BMS-INTERFACE_SPI_SCK (in), BMS-INTERFACE_SPI_MOSI (in), POL (in), PHA (in), SLOW (in), EN-BACKUP (in), CS (in)

### Ports
+3.3V_loc, BMS-INTERFACE_DIR (in), BMS-INTERFACE_SPI_CS (in), BMS-INTERFACE_SPI_MISO (out), BMS-INTERFACE_SPI_MOSI (in), BMS-INTERFACE_SPI_SCK (in), GND_loc, OUT_N (out), OUT_P (out), OUT_reverse_N (out), OUT_reverse_P (out)

### Nets
+3.3V_loc: C23.2 R13.2 R14.2 R23.2 U4.14(VCC) ; port +3.3V_loc, sheet U_0301_LTC6820_forward/+3.3V_loc, sheet U_0301_LTC6820_reverse/+3.3V_loc
GND_loc: C23.1 U4.7(GND) U4.15(EP) ; port GND_loc, sheet U_0301_LTC6820_forward/GND_loc, sheet U_0301_LTC6820_forward/POL, sheet U_0301_LTC6820_forward/PHA, sheet U_0301_LTC6820_forward/SLOW, sheet U_0301_LTC6820_forward/EN-BACKUP, sheet U_0301_LTC6820_reverse/GND_loc, sheet U_0301_LTC6820_reverse/POL, sheet U_0301_LTC6820_reverse/PHA, sheet U_0301_LTC6820_reverse/SLOW, sheet U_0301_LTC6820_reverse/EN-BACKUP
BMS-INTERFACE_DIR: R20.1 ; port BMS-INTERFACE_DIR
BMS-INTERFACE_SPI_MISO: R13.1 ; port BMS-INTERFACE_SPI_MISO, sheet U_0301_LTC6820_forward/BMS-INTERFACE_SPI_MISO, sheet U_0301_LTC6820_reverse/BMS-INTERFACE_SPI_MISO
BMS-INTERFACE_SPI_MOSI: R14.1 ; port BMS-INTERFACE_SPI_MOSI, sheet U_0301_LTC6820_forward/BMS-INTERFACE_SPI_MOSI, sheet U_0301_LTC6820_reverse/BMS-INTERFACE_SPI_MOSI
BMS-INTERFACE_SPI_SCK: port BMS-INTERFACE_SPI_SCK, sheet U_0301_LTC6820_forward/BMS-INTERFACE_SPI_SCK, sheet U_0301_LTC6820_reverse/BMS-INTERFACE_SPI_SCK
~{CS}: U4.4(2A) U4.5(2B) ; port BMS-INTERFACE_SPI_CS
~{CS_FW}: TP4.1 U4.8(3Y) ; sheet U_0301_LTC6820_forward/CS
~{CS_RV}: TP3.1 U4.11(4Y) ; sheet U_0301_LTC6820_reverse/CS
CS: TP1.1 U4.6(2Y) U4.10(3B) U4.13(4B)
~{DIR}: TP2.1 U4.3(1Y) U4.12(4A)
DIR: R20.2 R23.1 U4.1(1A) U4.2(1B) U4.9(3A)
OUT_N: port OUT_N, sheet U_0301_LTC6820_forward/ISO_OUT_N
OUT_P: port OUT_P, sheet U_0301_LTC6820_forward/ISO_OUT_P
OUT_reverse_N: port OUT_reverse_N, sheet U_0301_LTC6820_reverse/ISO_OUT_N
OUT_reverse_P: port OUT_reverse_P, sheet U_0301_LTC6820_reverse/ISO_OUT_P

### Channels
U_15_bms-interface_interface/Primary LTC6820: designators C23=C23_1 R13=R13_1 R14=R14_1 R20=R20_1 R23=R23_1 TP1=TP1_1 TP2=TP2_1#2 TP3=TP3_1#2 TP4=TP4_1#2 U4=U4_1; ports +3.3V_loc=+3.3V_0 BMS-INTERFACE_DIR=BMS-INTERFACE_0_GPIO_3 BMS-INTERFACE_SPI_CS=BMS-INTERFACE_0_SPI_CS BMS-INTERFACE_SPI_MISO=BMS-INTERFACE_0_SPI_MISO BMS-INTERFACE_SPI_MOSI=BMS-INTERFACE_0_SPI_MOSI BMS-INTERFACE_SPI_SCK=BMS-INTERFACE_0_SPI_SCK GND_loc=GND OUT_N=OUT_N OUT_P=OUT_P OUT_reverse_N=OUT_N OUT_reverse_P=OUT_P
U_15_bms-interface_interface/Secondary LTC6820: designators C23=C23_2 R13=R13_2 R14=R14_2 R20=R20_2 R23=R23_2 TP1=TP1_2 TP2=TP2_2#2 TP3=TP3_2#2 TP4=TP4_2#2 U4=U4_2; ports +3.3V_loc=+3.3V_0 BMS-INTERFACE_DIR=BMS-INTERFACE_1_GPIO_3 BMS-INTERFACE_SPI_CS=BMS-INTERFACE_1_SPI_CS BMS-INTERFACE_SPI_MISO=BMS-INTERFACE_1_SPI_MISO BMS-INTERFACE_SPI_MOSI=BMS-INTERFACE_1_SPI_MOSI BMS-INTERFACE_SPI_SCK=BMS-INTERFACE_1_SPI_SCK GND_loc=GND OUT_N=OUT_N OUT_P=OUT_P OUT_reverse_N=OUT_N OUT_reverse_P=OUT_P

### Notes on the sheet
- (near R13) Suppressed Warning: multiple outputs (only one active at a time)
- Replace with SN74LVC00AQPWRQ1 for automotive applications.
- DIR HIGH: CS_FW = CS; CS_RV = 1
  DIR LOW: CS_RV = CS; CS_FW = 1
- Truth table
  |   DIR   |   !CS   | !CS_FW  | !CS_RV  |
  -----------------------------------------
  |    0    |    0    |    1    |    0    |
  |    0    |    1    |    1    |    1    |
  |    1    |    0    |    0    |    1    |
  |    1    |    1    |    1    |    1    |
- Fraunhofer IISB
- Schottkystr. 10
- developed by:
- 91058 Erlangen
- Germany
- Author
- Project
- License
- Description
- File
- Version
- Release Date
- Sheet
- www.foxbms.org
- www.iisb.fraunhofer.de
- foxBMS Team
- /

### Library data of the parts
C23 = gen_C_ceramic_100n_50V_X7R_0603: MLCC; Capacitance: 100n; Rated Voltage: 50V; Dielectric: X7R; Case EIA: 0603; Case Metric: 1608; PnP Package: C_0603_10; PnP Value: 100n/50V/X7R; PnP equipped: x; Automotive Qualified: True; Part Number: gen_C_ceramic_100n_50V_X7R_0603; Supplier 1: Farnell; Supplier Part Number 1: 2525267; Supplier 2: Digikey; Supplier Part Number 2: 490-6049-1-ND; Supplier 3: Farnell; Supplier Part Number 3: 2070398
R13 R14 = gen_R_2k_0603: SMD Resistor 2k 0603; Tolerance: 1%; Power: 0.1W; Case EIA: 0603; Case Metric: 1608; Maximum Working Voltage: 75V; PnP Package: R_0603; Automotive Qualified: True; Part Number: gen_R_2k_0603; Operating Temperature: -55°C - +155°C; Resistance: 2k; Series: E24, E96; PnP Value: 2k; Supplier 1: Farnell; Supplier Part Number 1: 2059343
R20 = gen_R_0R_0603: SMD Resistor 0R 0603; Power: 0.1W; Case EIA: 0603; Case Metric: 1608; Maximum Working Voltage: 75V; PnP Package: R_0603; Automotive Qualified: True; Part Number: gen_R_0R_0603; Operating Temperature: -55°C - +155°C; Resistance: 0R; Series: Jumper; PnP Value: 0R; Supplier 1: Farnell; Supplier Part Number 1: 2616580
R23 = gen_R_20k_0603: SMD Resistor 20k 0603; Tolerance: 1%; Power: 0.1W; Case EIA: 0603; Case Metric: 1608; Maximum Working Voltage: 75V; PnP Package: R_0603; Automotive Qualified: True; Part Number: gen_R_20k_0603; Operating Temperature: -55°C - +155°C; Resistance: 20k; Series: E24, E96; PnP Value: 20k; Supplier 1: Farnell; Supplier Part Number 1: 2059432
TP1-TP4 = Testpoint_Square: Testpoint, square; Part Number: Testpoint_Square
U4 = CMP-1627-00656-3: Quadruple 2-Input Positive-NAND Gate, RGY0014A, LARGE T&R; Manufacturer: Texas Instruments; tpd @ Nom Voltage(Max)(ns): 12.5,6.4,5.1,4.3; Input Type: TTL; Output Drive (IOL/IOH)(Max)(mA): 24/-24; VCC(Max)(V): 3.6; Voltage(Nom)(V): 1.8,2.5,2.7,3.3; VCC(Min)(V): 1.65; ICC @ Nom Voltage(Max)(mA): 0.04; F @ Nom Voltage(Max)(Mhz): 150; Rating: Catalog; Technology Family: LVC; Schmitt Trigger: No; Generic Part Number: SN74LVC00A; PackageReference: RGY0014A; Output Type: TTL; Code_JEDEC: MO-241; Operating Temperature Range(C): -40 to 125; DatasheetVersion: SCAS279Q

## Sheet 0301_LTC6820_chip.SchDoc
size A3; DocumentNumber: 6; SheetNumber: 6; SheetTotal: 6; SheetDescription: LTC6820
Used 4 times, as channels U_15_bms-interface_interface/Primary LTC6820/U_0301_LTC6820_forward, U_15_bms-interface_interface/Primary LTC6820/U_0301_LTC6820_reverse, U_15_bms-interface_interface/Secondary LTC6820/U_0301_LTC6820_forward, U_15_bms-interface_interface/Secondary LTC6820/U_0301_LTC6820_reverse. Parts and nets are listed once, with the designators drawn on the sheet.
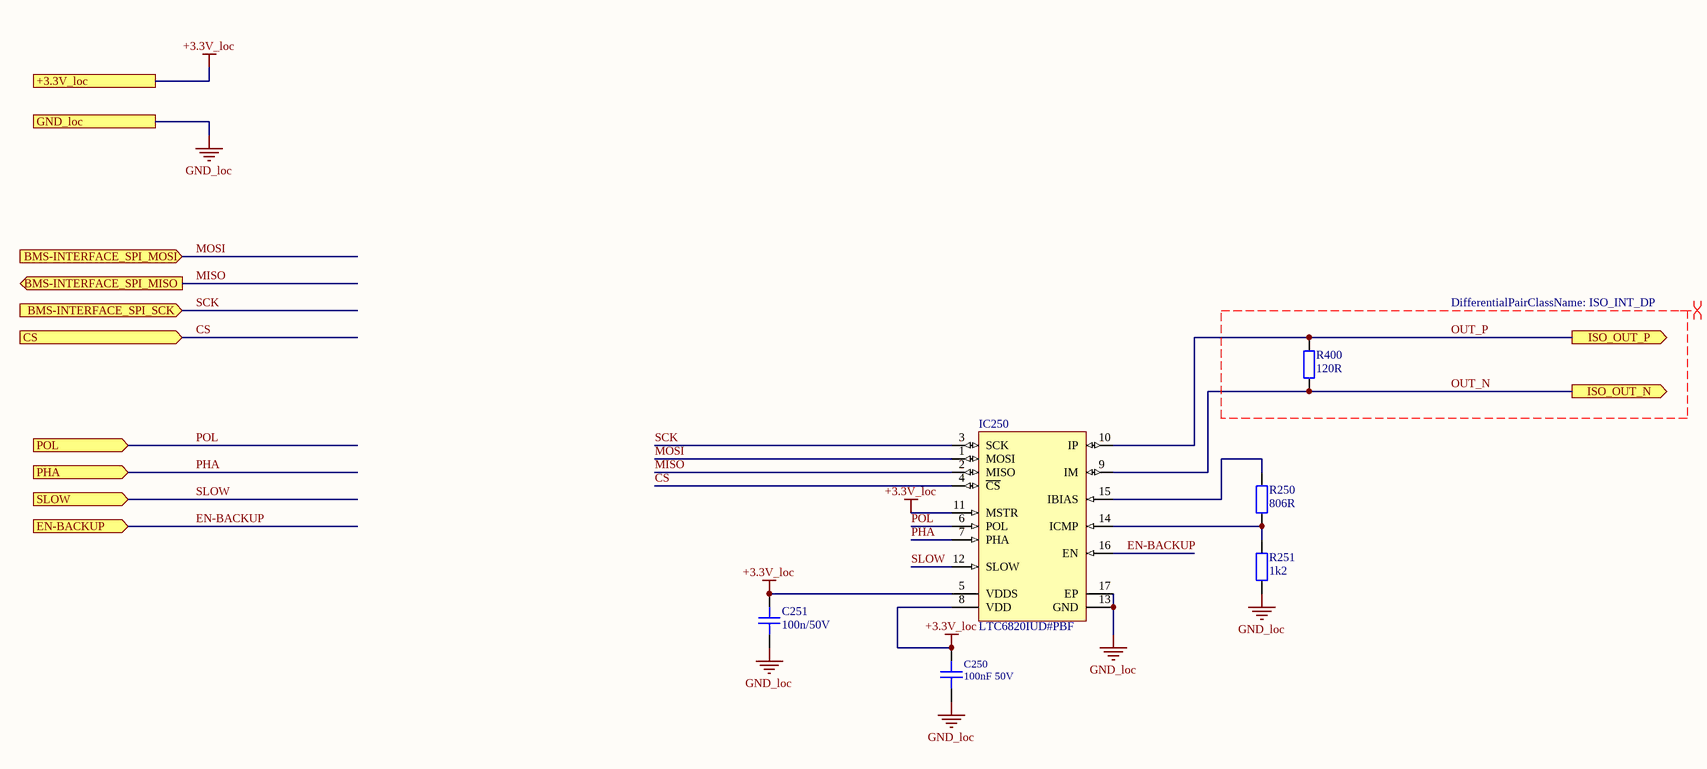
[diagram p22: 0301_LTC6820_chip.SchDoc]

### Parts
C250  100nF 50V  [0603C]
C251  100n/50V  [0603C]
IC250  LTC6820IUD#PBF  [LT-UD-16-EPV-AA_L]
R250  806R  [0603R]
R251  1k2  [0603R]
R400  120R  [0603R]

### Ports
+3.3V_loc, BMS-INTERFACE_SPI_MISO (out), BMS-INTERFACE_SPI_MOSI (in), BMS-INTERFACE_SPI_SCK (in), CS (in), EN-BACKUP (in), GND_loc, ISO_OUT_N (out), ISO_OUT_P (out), PHA (in), POL (in), SLOW (in)

### Nets
+3.3V_loc: C250.2 C251.2 IC250.5(VDDS) IC250.8(VDD) IC250.11(MSTR) ; port +3.3V_loc
GND_loc: C250.1 C251.1 IC250.13(GND) IC250.17(EP) R251.1 ; port GND_loc
CS: IC250.4(~{CS}) ; port CS
EN-BACKUP: IC250.16(EN) ; port EN-BACKUP
MISO: IC250.2(MISO) ; port BMS-INTERFACE_SPI_MISO
MOSI: IC250.1(MOSI) ; port BMS-INTERFACE_SPI_MOSI
OUT_N: IC250.9(IM) R400.1 ; port ISO_OUT_N
OUT_P: IC250.10(IP) R400.2 ; port ISO_OUT_P
PHA: IC250.7(PHA) ; port PHA
POL: IC250.6(POL) ; port POL
SCK: IC250.3(SCK) ; port BMS-INTERFACE_SPI_SCK
SLOW: IC250.12(SLOW) ; port SLOW
NetIC250_14: IC250.14(ICMP) R250.1 R251.2
NetIC250_15: IC250.15(IBIAS) R250.2

### Channels
U_15_bms-interface_interface/Primary LTC6820/U_0301_LTC6820_forward: designators end in _1; ports +3.3V_loc=+3.3V_0 BMS-INTERFACE_SPI_MISO=BMS-INTERFACE_0_SPI_MISO BMS-INTERFACE_SPI_MOSI=BMS-INTERFACE_0_SPI_MOSI BMS-INTERFACE_SPI_SCK=BMS-INTERFACE_0_SPI_SCK CS=~{CS_FW}_Primary LTC6820 EN-BACKUP=GND GND_loc=GND ISO_OUT_N=OUT_N ISO_OUT_P=OUT_P PHA=GND POL=GND SLOW=GND
U_15_bms-interface_interface/Primary LTC6820/U_0301_LTC6820_reverse: designators end in _2; ports +3.3V_loc=+3.3V_0 BMS-INTERFACE_SPI_MISO=BMS-INTERFACE_0_SPI_MISO BMS-INTERFACE_SPI_MOSI=BMS-INTERFACE_0_SPI_MOSI BMS-INTERFACE_SPI_SCK=BMS-INTERFACE_0_SPI_SCK CS=~{CS_RV}_Primary LTC6820 EN-BACKUP=GND GND_loc=GND ISO_OUT_N=OUT_N ISO_OUT_P=OUT_P PHA=GND POL=GND SLOW=GND
U_15_bms-interface_interface/Secondary LTC6820/U_0301_LTC6820_forward: designators end in _3; ports +3.3V_loc=+3.3V_0 BMS-INTERFACE_SPI_MISO=BMS-INTERFACE_1_SPI_MISO BMS-INTERFACE_SPI_MOSI=BMS-INTERFACE_1_SPI_MOSI BMS-INTERFACE_SPI_SCK=BMS-INTERFACE_1_SPI_SCK CS=~{CS_FW}_Secondary LTC6820 EN-BACKUP=GND GND_loc=GND ISO_OUT_N=OUT_N ISO_OUT_P=OUT_P PHA=GND POL=GND SLOW=GND
U_15_bms-interface_interface/Secondary LTC6820/U_0301_LTC6820_reverse: designators end in _4; ports +3.3V_loc=+3.3V_0 BMS-INTERFACE_SPI_MISO=BMS-INTERFACE_1_SPI_MISO BMS-INTERFACE_SPI_MOSI=BMS-INTERFACE_1_SPI_MOSI BMS-INTERFACE_SPI_SCK=BMS-INTERFACE_1_SPI_SCK CS=~{CS_RV}_Secondary LTC6820 EN-BACKUP=GND GND_loc=GND ISO_OUT_N=OUT_N ISO_OUT_P=OUT_P PHA=GND POL=GND SLOW=GND

### Layout directives
differential pair; differential pair class ISO_INT_DP; rule Differential Pairs Routing [Pref Gap = 25.59mil    Min Gap  = 5mil    Max Gap  = 78.74milPref Width = 6mil    Min Width  = 0.955mil    Max Width  = 10.997mil]: OUT_N, OUT_P

### Notes on the sheet
- Fraunhofer IISB
- Schottkystr. 10
- developed by:
- 91058 Erlangen
- Germany
- Author
- Project
- License
- Description
- File
- Version
- Release Date
- Sheet
- www.foxbms.org
- www.iisb.fraunhofer.de
- foxBMS Team
- /

### Library data of the parts
C250 = gen_C_ceramic_100n_50V_X7R_0603: Ceramic, 100nF, ±10%, 50V, X7R, –55 to 125°C, 0603 (1608),RoHS, Automotive; Part Number: GCJ188R71H104KA12; Manufacturer: Murata; Capacitance: 100n; Case EIA: 0603; Case Metric: 1608; PnP Package: C_0603_10; PnP Value: 100nF/50V/X7R; Automotive Qualified: True; Rated Voltage: 50V; Dielectric: X7R; Supplier 1: Digi-Key; Supplier Part Number 1: 490-5798-1-ND; Height - Seated (Max): 0.8mm; Mounting Type: SurfaceMount,MLCC; Operating Temperature: –55 to 125°C; Series: GCJ; Tolerance: ±10%; Manufacturer_Part_Number: GCJ188R71H104KA12
C251 = gen_C_ceramic_100n_50V_X7R_0603: as C23 on sheet 03_LTC6820; Part Number: gen_C_ceramic_100n_50V_X7R_0603; Supplier 1: Farnell; Supplier Part Number 1: 2525267; Supplier 2: Digikey; Supplier Part Number 2: 490-6049-1-ND; Supplier 3: Farnell; Supplier Part Number 3: 2070398
IC250 = CMP-0937-00013-1: IsoSPI Isolated Communication Interface, 2.7 to 5.5 V, -40 to 85 degC, 16-Pin QFN (UD-16EPV-AA), Pb-Free; Manufacturer: Linear Technology; VBIAS: 1.9 to 2.1 V; Receiver Input Resistance: 35 kOhm; IO Supply Voltage Range: 1.7 to 5.5 V; IO Supply Current: 1 uA Max.; Supply Current, IDLE State: 2 uA; ComponentLink3URL: http://cds.linear.com/docs/en/packaging/QFN_16_05-08-1700.pdf; PackageReference: UD-16EPV-AA; ComponentLink1URL: http://www.linear.com/; PartNumber: LTC6820IUD#PBF; Temperature Range (degC): -40 to 85; Mounting Technology: Surface Mount; PackageDescription: 16-Pin Quad Flat No-lead Package, Body 3 x 3 mm, Pitch 0.5 mm; DatasheetVersion: Rev. A; ComponentLink2Description: Datasheet; ComponentLink1Description: Manufacturer URL; PackageVersion: Rev. A; Power Supply: 2.7 to 5.5 V; ComponentLink2URL: http://cds.linear.com/docs/en/datasheet/6820fa.pdf; ComponentLink3Description: Package Specification
R250 = gen_R_806R_0603: SMD Resistor 806R 0603; Tolerance: 1%; Power: 0.1W; Case EIA: 0603; Case Metric: 1608; Maximum Working Voltage: 75V; PnP Package: R_0603; Automotive Qualified: True; Part Number: gen_R_806R_0603; Operating Temperature: -55°C - +155°C; Resistance: 806R; Series: E96; PnP Value: 806R; Supplier 1: Farnell; Supplier Part Number 1: 2059324
R251 = gen_R_1k2_0603: SMD Resistor 1k2 0603; Tolerance: 1%; Power: 0.1W; Case EIA: 0603; Case Metric: 1608; Maximum Working Voltage: 75V; PnP Package: R_0603; Automotive Qualified: True; Part Number: gen_R_1k2_0603; Operating Temperature: -55°C - +155°C; Resistance: 1k2; Series: E24; PnP Value: 1k2; Supplier 1: Farnell; Supplier Part Number 1: 2073370
R400 = gen_R_120R_0603: SMD Resistor 120R 0603; Tolerance: 1%; Power: 0.1W; Case EIA: 0603; Case Metric: 1608; Maximum Working Voltage: 75V; PnP Package: R_0603; Automotive Qualified: True; Part Number: gen_R_120R_0603; Operating Temperature: -55°C - +155°C; Resistance: 120R; Series: E24; PnP Value: 120R; Supplier 1: Farnell; Supplier Part Number 1: 1652832

## Sheet bms-slave-magnetics.SchDoc: foxBMS BMS-Interface
size A3; DocumentNumber: 4; SheetNumber: 4; SheetTotal: 6; Author: Fraunhofer IISB foxBMS Team; REL-DATE: 2017-05-09; VERSION: 1.1.0; GateName_1: G$1; SymbolName_1: FRAME_B_L; LibraryName: foxBMS_BMS-Master_V1.00_A; DeviceSetName: FRAME_B_L; GateName_2: G$2; SymbolName_2: DOCFIELD; SheetDescription: Daisy Chain Isolation
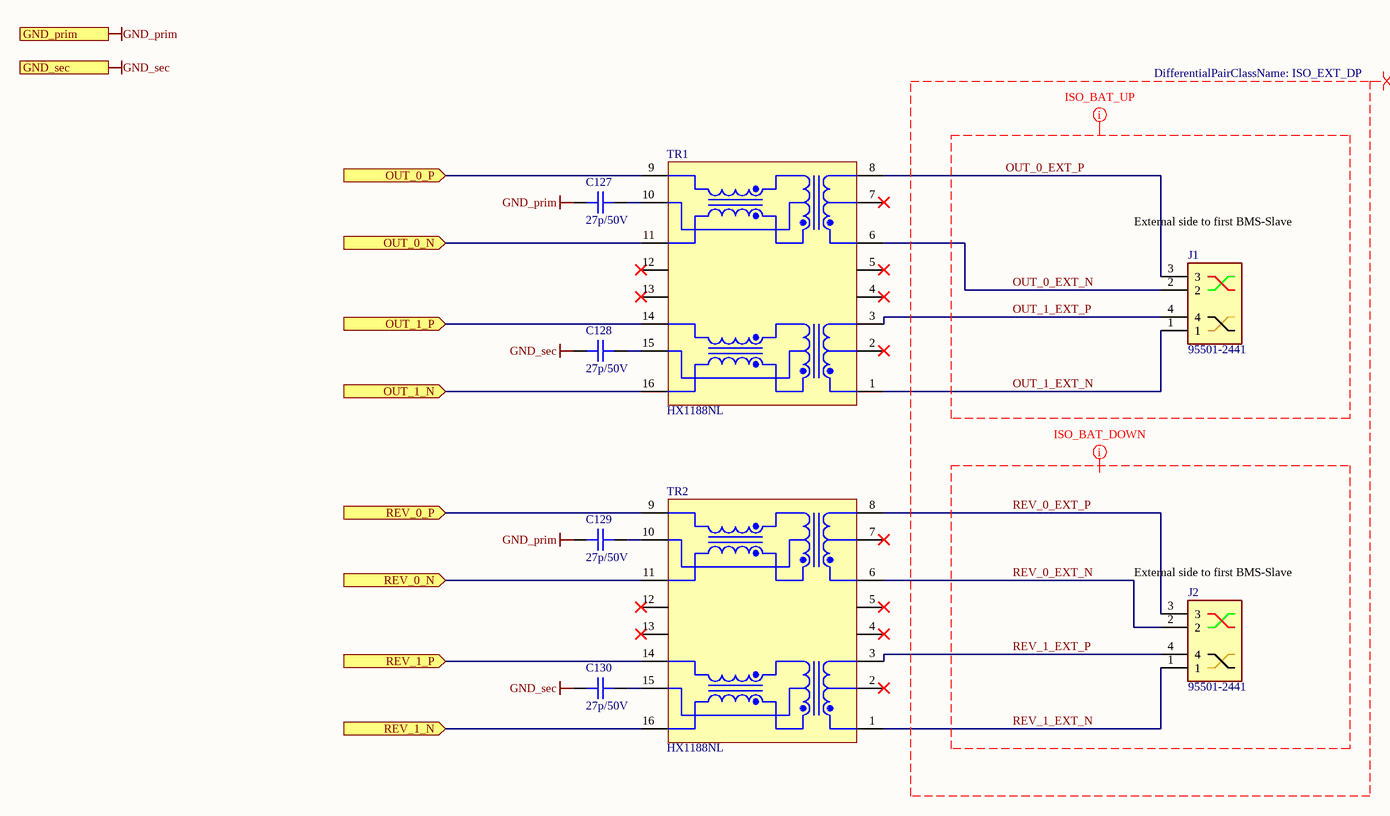
[diagram p23: bms-slave-magnetics.SchDoc]

### Parts
C127  27p/50V  [0603C]
C128  27p/50V  [0603C]
C129  27p/50V  [0603C]
C130  27p/50V  [0603C]
J1  95501-2441  [95501-2441]
J2  95501-2441  [95501-2441]
TR1  HX1188NL  [PULS-MODULE-16_V]
TR2  HX1188NL  [PULS-MODULE-16_V]

### Ports
GND_prim, GND_sec, OUT_0_N (in), OUT_0_P (in), OUT_1_N (in), OUT_1_P (in), REV_0_N (in), REV_0_P (in), REV_1_N (in), REV_1_P (in)

### Nets
GND_prim: C127.2 C128.1 C129.2 C130.1 ; port GND_prim, port GND_sec  [also labelled GND_sec]  [project net GND]
OUT_0_EXT_N: J1.2 TR1.6
OUT_0_EXT_P: J1.3 TR1.8
OUT_1_EXT_N: J1.1 TR1.1
OUT_1_EXT_P: J1.4 TR1.3
OUT_N: TR1.11 ; port OUT_0_N
OUT_N: TR2.11 ; port REV_0_N  [a separate net that carries the same name]
OUT_N: TR1.16 ; port OUT_1_N  [a separate net that carries the same name]
OUT_N: TR2.16 ; port REV_1_N  [a separate net that carries the same name]
OUT_P: TR1.9 ; port OUT_0_P
OUT_P: TR2.9 ; port REV_0_P  [a separate net that carries the same name]
OUT_P: TR1.14 ; port OUT_1_P  [a separate net that carries the same name]
OUT_P: TR2.14 ; port REV_1_P  [a separate net that carries the same name]
REV_0_EXT_N: J2.2 TR2.6
REV_0_EXT_P: J2.3 TR2.8
REV_1_EXT_N: J2.1 TR2.1
REV_1_EXT_P: J2.4 TR2.3
NetC127_1: C127.1 TR1.10
NetC128_2: C128.2 TR1.15
NetC129_1: C129.1 TR2.10
NetC130_2: C130.2 TR2.15

Not connected (* = marked no-connect by the designer): TR1 2* 4* 5* 7* 12* 13*; TR2 2* 4* 5* 7* 12* 13*

### Layout directives
net class ISO_BAT; net class ISO_BAT_UP: OUT_0_EXT_N, OUT_0_EXT_P, OUT_1_EXT_N, OUT_1_EXT_P
net class ISO_BAT; net class ISO_BAT_DOWN: REV_0_EXT_N, REV_0_EXT_P, REV_1_EXT_N, REV_1_EXT_P
differential pair; differential pair class ISO_EXT_DP; rule Differential Pairs Routing [Pref Gap = 25.59mil    Min Gap  = 5mil    Max Gap  = 78.74milPref Width = 6mil    Min Width  = 0.955mil    Max Width  = 10.997mil]: OUT_0_EXT_N, OUT_0_EXT_P, OUT_1_EXT_N, OUT_1_EXT_P, REV_0_EXT_N, REV_0_EXT_P, REV_1_EXT_N, REV_1_EXT_P

### Notes on the sheet
- (near J1) External side to first BMS-Slave
- (near J2) External side to first BMS-Slave
- Fraunhofer IISB
- Schottkystr. 10
- developed by:
- 91058 Erlangen
- Germany
- Author
- Project
- License
- Description
- File
- Version
- Release Date
- Sheet
- www.foxbms.org
- www.iisb.fraunhofer.de
- foxBMS Team
- /

### Library data of the parts
C127-C130 = gen_C_ceramic_27p_50V_NP0_0603: MLCC; Capacitance: 27p; Rated Voltage: 50V; Dielectric: NP0; Case EIA: 0603; Case Metric: 1608; PnP Package: C_0603_05; Automotive Qualified: True; Part Number: gen_C_ceramic_27p_50V_NP0_0603; Supplier 1: Farnell; Supplier Part Number 1: 2219430; PnP Value: *
J1 J2 = 95501-2441: Connector; Manufacturer_Name: Molex; Allied_Number: 70372436; Datasheet Link: http://www.molex.com/webdocs/datasheets/pdf/en-us/0955012441_MODULAR_JACKS_PLUG.pdf; Manufacturer_Part_Number: 95501-2441; Mouser Part Number: 538-95501-2441; Mouser Price/Stock: https://www.mouser.com/Search/Refine.aspx?Keyword=538-95501-2441; RS Part Number: 2400913; RS Price/Stock: https://uk.rs-online.com/web/p/products/2400913; Allied Price/Stock: http://www.alliedelec.com/molex-incorporated-95501-2441/70372436/
TR1 TR2 = CMP-2000-05323-1: 10/100 Base-T Single Port Surface Mount Magnetic with Turns Ratio, -40 to 85 degC, 16-Pin Module, RoHS, Tube; Manufacturer: Pulse Electronics; Other Related Documents: PackagesFNLvs.NL; Other Names: 553-1340; PCN Design/Specification: ThermoplasticHeaderDesign28/Jun/2013; Transformer Type: IsolationandDataInterface(Encapsulated); PCN Other: HaloInjunctionRes1/Sep/2015; Turns Ratio - Primary: Secondary:1:1Transmitter,1:1Receiver; Family: PulseTransformers; Datasheet URL: https://datasheet.ciiva.com/26929/hx1188nl-26929858.pdf; Mounting Type: SurfaceMount; Size / Dimension: 12.70mmLx7.11mmW; Inductance: -; Package Description: 16-Pin Surface Mount Device, Body 12.7 x 7.11 mm, Pitch 1.27 mm; Height - Seated (Max): 6.22mm; E.T.: -; Online Catalog: 10/100BASE-TSinglePort; Manufacturer URL: http://www.pulseelectronics.com/; Package Reference: MODULE-16; Series: -; Category: Transformers; Standard Package: 40; Datasheet Version: Rev. H325.Q, 09/2009

## Sheet isolated_rs485.SchDoc: foxBMS BMS-Extension
size A3; DocumentNumber: 9; SheetNumber: 9; SheetTotal: 14; Author: Fraunhofer IISB foxBMS Team; REL-DATE: 2017-05-16; VERSION: 1.0.2; GateName_1: G$1; SymbolName_1: FRAME_B_L; LibraryName: foxBMS_BMS-Master_V1.00_A; DeviceSetName: FRAME_B_L; GateName_2: G$2; SymbolName_2: DOCFIELD; SheetDescription: Isolated RS485
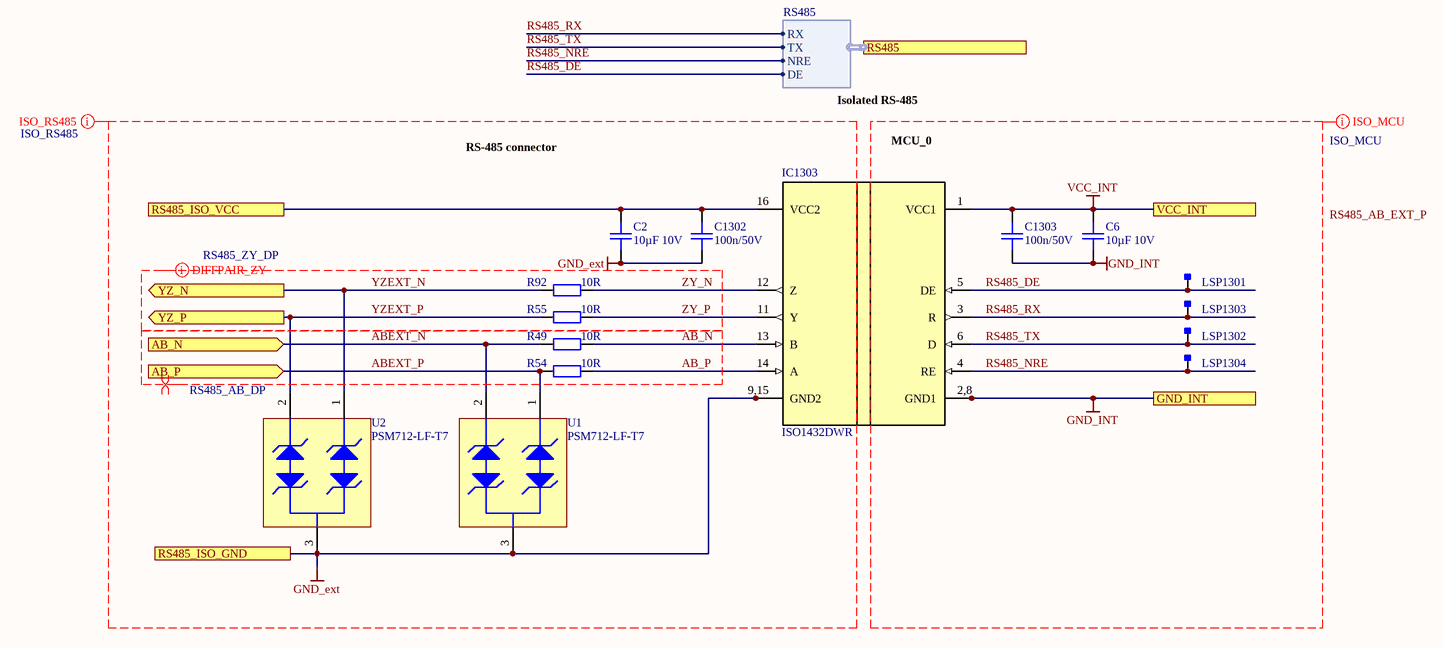
[diagram p24: isolated_rs485.SchDoc]

### Parts
(Parts that share a designator on the sheet are numbered #1, #2 ... from top to bottom, then left to right.)
C2#1  10µF 10V  [0805C]
C6  10µF 10V  [0805C]
C1302  100n/50V  [0603C]
C1303  100n/50V  [0603C]
IC1303  ISO1432DWR  [DW0016B_N]
LSP1301  Testpoint_Square  [Testpoint_S1]  (value not drawn)  (no BOM)
LSP1302  Testpoint_Square  [Testpoint_S1]  (value not drawn)  (no BOM)
LSP1303  Testpoint_Square  [Testpoint_S1]  (value not drawn)  (no BOM)
LSP1304  Testpoint_Square  [Testpoint_S1]  (value not drawn)  (no BOM)
R49#2  10R  [0603R]
R54  10R  [0603R]
R55  10R  [0603R]
R92  10R  [0603R]
U1  PSM712-LF-T7  [PRKT-SOT23-3_V]
U2  PSM712-LF-T7  [PRKT-SOT23-3_V]

### Ports
AB_N (in), AB_P (in), GND_INT, RS485 (harness RS485), RS485_ISO_GND, RS485_ISO_VCC, VCC_INT, YZ_N (out), YZ_P (out)

### Harnesses
RS485: RX, TX, NRE, DE

### Nets
+3.3V_COM: C2#1.1 C1302.1 IC1303.16(VCC2) ; port RS485_ISO_VCC
GND_ext: C2#1.2 C6.2 C1302.2 C1303.2 IC1303.2,8(GND1) IC1303.8 IC1303.9,15(GND2) IC1303.15 U1.3 U2.3 ; port RS485_ISO_GND, port GND_INT  [also labelled GND_INT]  [project net GND]
VCC_INT: C6.1 C1303.1 IC1303.1(VCC1) ; port VCC_INT  [project net +3.3V_0]
AB_N: IC1303.13(B) R49#2.2
AB_P: IC1303.14(A) R54.2
ABEXT_N: R49#2.1 U1.2 ; port AB_N
ABEXT_P: R54.1 U1.1 ; port AB_P
RS485_DE: IC1303.5(DE) LSP1301.1 ; port RS485.DE
RS485_NRE: IC1303.4(RE) LSP1304.1 ; port RS485.NRE  [project net RS485_MCU_0_NRE]
RS485_RX: IC1303.3(R) LSP1303.1 ; port RS485.RX  [project net RS485_MCU_0_RX]
RS485_TX: IC1303.6(D) LSP1302.1 ; port RS485.TX  [project net RS485_MCU_0_TX]
YZEXT_N: R92.1 U2.1 ; port YZ_N  [project net RS485_YZ_N]
YZEXT_P: R55.1 U2.2 ; port YZ_P  [project net RS485_YZ_P]
ZY_N: IC1303.12(Z) R92.2
ZY_P: IC1303.11(Y) R55.2

Not connected (* = marked no-connect by the designer): IC1303 7(NC) 10(NC)

### Layout directives
net class ISO_MCU: GND_INT, RS485_DE, RS485_NRE, RS485_RX, RS485_TX, VCC_INT
net class ISO_RS485: AB_N, AB_P, ABEXT_N, ABEXT_P, GND_ext, YZEXT_N, YZEXT_P, ZY_N, ZY_P
differential pair; differential pair class RS485_ZY_DP; rule Differential Pairs Routing [Pref Gap = 0.65mm    Min Gap  = 0.127mm    Max Gap  = 2mmPref Width = 0.152mm    Min Width  = 0.024mm    Max Width  = 0.279mm]: YZEXT_N, YZEXT_P, ZY_N, ZY_P
differential pair; differential pair class RS485_AB_DP; rule Differential Pairs Routing [Pref Gap = 0.65mm    Min Gap  = 0.127mm    Max Gap  = 2mmPref Width = 0.152mm    Min Width  = 0.024mm    Max Width  = 0.279mm]: AB_N, AB_P, ABEXT_N, ABEXT_P

### Notes on the sheet
- Isolated RS-485
- RS-485 connector
- MCU_0
- Labels drawn without touching a wire or pin: RS485_AB_EXT_P
- Fraunhofer IISB
- Schottkystr. 10
- developed by:
- 91058 Erlangen
- Germany
- Author
- Project
- License
- Description
- File
- Version
- Release Date
- Sheet
- www.foxbms.org
- www.iisb.fraunhofer.de
- foxBMS Team
- /

### Library data of the parts
C2#1 C6 = gen_C_ceramic_10u_10V_X7R_0805: Ceramic, 10µF, ±10%, 10V, X7R, –55 to 125°C, 0805 (2012),RoHS, Automotive; Part Number: GCJ21BR71A106KE01; Manufacturer: Murata; Case EIA: 0805; Case Metric: 2012; Automotive Qualified: True; PnP Package: C_0805_10; PnP Value: 10µF/10V/X7R; Capacitance: 10µF; Rated Voltage: 10V; Dielectric: X7R; Supplier 1: Digi-Key; Supplier Part Number 1: 490-12646-1-ND; Height - Seated (Max): 1.25mm; Mounting Type: SurfaceMount,MLCC; Operating Temperature: –55 to 125°C; Series: GCJ; Tolerance: ±10%; Manufacturer_Part_Number: GCJ21BR71A106KE01
C1302 C1303 = gen_C_ceramic_100n_50V_X7R_0603: MLCC; Capacitance: 100n; Rated Voltage: 50V; Dielectric: X7R; Case EIA: 0603; Case Metric: 1608; PnP Package: C_0603_10; PnP Value: 100n/50V/X7R; PnP equipped: x; Part Number: gen_C_ceramic_100n_50V_X7R_0603; Supplier 1: Farnell; Supplier Part Number 1: 2525267
IC1303 = ISO1432DWR: 5-kVrms isolated RS-485/RS-422 transceiver with robust EMC; Manufacturer: Texas Instruments; PartNumber: ISO1432DWR; RefDes: RefDes; TYPE: TYPE; Value: Value; Part Number: ISO1432DWR
LSP1301-LSP1304 = Testpoint_Square: Testpoint, square; Part Number: Testpoint_Square
R49#2 R54 R55 R92 = gen_R_10R_0603: SMD Resistor 10R 0603; Tolerance: 1%; Power: 0.1W; Case EIA: 0603; Case Metric: 1608; Maximum Working Voltage: 75V; PnP Package: R_0603; Automotive Qualified: False; Part Number: gen_R_10R_0603; Operating Temperature: -55°C - +155°C; Resistance: 10R; Series: E24, E96; PnP Value: 10R; Supplier 1: Farnell; Supplier Part Number 1: 2073361
U1 U2 = CMP-2000-07553-1: TVS Array - Asymmetrical Data Line Protector, 600 W, 7.5 V, -55 to 150 degC, 3-Pin SOT23, RoHS, Tape and Reel; Manufacturer: Protek Devices; Min Breakdown Voltage: 7.5V; Direction: Bidirectional; Capacitance: 75pF; Current: 20uA; Power Dissipation: 600W; Working Voltage: 7V; Voltage: 12V; Case\/Package: SOT-23; Clamping Voltage: 17V; Element Configuration: Dual; Mounting Technology: SurfaceMount; RoHSCompliant: True; Radiation Hardening: No; Depth: 1.4mm; Lead Free: LeadFree; Package Description: 3-Pin Small Outline Transistor, Body 2.92 x 1.3 mm, Pitch 0.94 mm; Max Operating Temperature: 150degC; Length: 3.04mm; Manufacturer URL: http://www.protekdevices.com/; Min Operating Temperature: -55degC; Leakage Current: 20uA; Datasheet URL: www.protekdevices.com/xyz/documents/datasheets/psm712.pdf; Packaging: TapeandReel; Datasheet Version: 10/2013; Package Reference: SOT23-3; Number of Pins: 3